# Altium project 110-00315-D_B1-DevKit_1.PrjPcb (part 3 of 5)

## Sheet 7-IO_Headers.SchDoc: B1 DevKit (DK-B1)
size 431 x 279 mm; Organization: ORGANIZATION; Address1: ADDRESS 1; Address2: ADDRESS 2; Address3: ADDRESS 3; Address4: ADDRESS 4; DocumentNumber: 7; Revision: -; SheetNumber: 7; SheetTotal: 14; ENG_APP_DATE: --/--/--; DSN_APP_DATE: --/--/--; CHK_APP_DATE: --/--/--
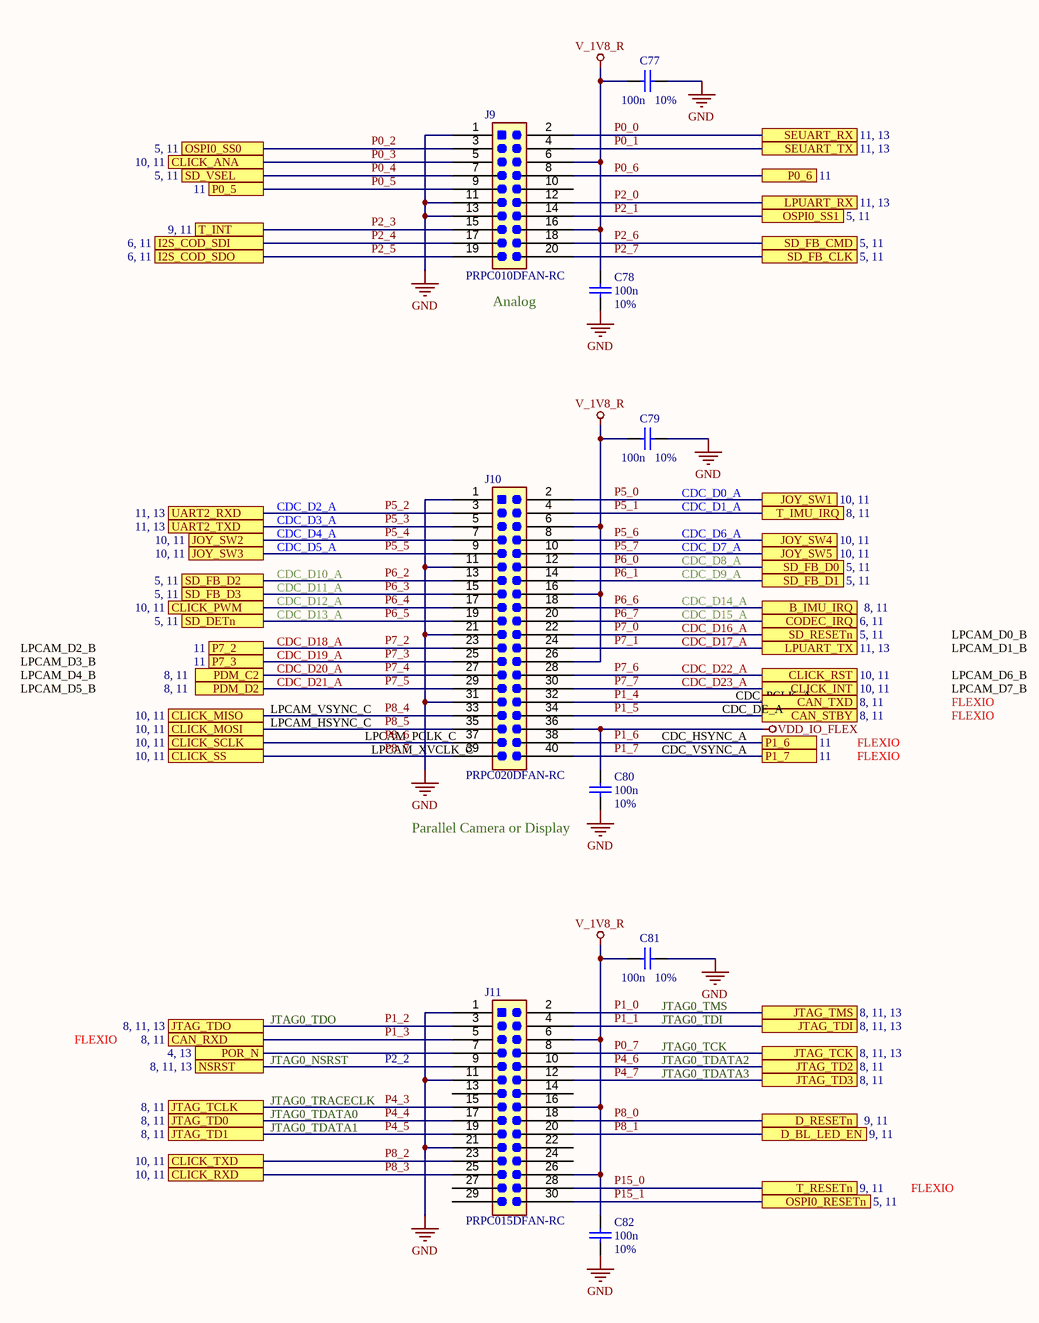
[diagram p6: 7-IO_Headers.SchDoc]

### Parts
C77  value 100n  Tolerance: 10%  [CAPC0402-01]  (hidden comment: Cap)
C78  value 100n  Tolerance: 10%  [CAPC0402-01]  (hidden comment: Cap)
C79  value 100n  Tolerance: 10%  [CAPC0402-01]  (hidden comment: Cap)
C80  value 100n  Tolerance: 10%  [CAPC0402-01]  (hidden comment: Cap)
C81  value 100n  Tolerance: 10%  [CAPC0402-01]  (hidden comment: Cap)
C82  value 100n  Tolerance: 10%  [CAPC0402-01]  (hidden comment: Cap)
J9  PRPC010DFAN-RC  [CON20_2X10_P100UM_HDR_TYC]
J10  PRPC020DFAN-RC  [CON40_2X20_P100UM_HDR_TYC]
J11  PRPC015DFAN-RC  [CON30_2X15_P100UM_HDR_TYC]

### Ports
B_IMU_IRQ (see 8, 11), CAN_RXD (see 8, 11), CAN_STBY (see 8, 11), CAN_TXD (see 8, 11), CLICK_ANA (see 10, 11), CLICK_INT (see 10, 11), CLICK_MISO (see 10, 11), CLICK_MOSI (see 10, 11), CLICK_PWM (see 10, 11), CLICK_RST (see 10, 11), CLICK_RXD (see 10, 11), CLICK_SCLK (see 10, 11), CLICK_SS (see 10, 11), CLICK_TXD (see 10, 11), CODEC_IRQ (see 6, 11), D_BL_LED_EN (see 9, 11), D_RESETn (see 9, 11), I2S_COD_SDI (see 6, 11), I2S_COD_SDO (see 6, 11), JOY_SW1 (see 10, 11), JOY_SW2 (see 10, 11), JOY_SW3 (see 10, 11), JOY_SW4 (see 10, 11), JOY_SW5 (see 10, 11), JTAG_TCK (see 8, 11, 13), JTAG_TCLK (see 8, 11), JTAG_TD0 (see 8, 11), JTAG_TD1 (see 8, 11), JTAG_TD2 (see 8, 11), JTAG_TD3 (see 8, 11), JTAG_TDI (see 8, 11, 13), JTAG_TDO (see 8, 11, 13), JTAG_TMS (see 8, 11, 13), LPUART_RX (see 11, 13), LPUART_TX (see 11, 13), NSRST (see 8, 11, 13), OSPI0_RESETn (see 5, 11), OSPI0_SS0 (see 5, 11), OSPI0_SS1 (see 5, 11), P0_5 (see 11), P0_6 (see 11), P1_6 (see 11), P1_7 (see 11), P7_2 (see 11), P7_3 (see 11), PDM_C2 (see 8, 11), PDM_D2 (see 8, 11), POR_N (see 4, 13), SD_DETn (see 5, 11), SD_FB_CLK (see 5, 11), SD_FB_CMD (see 5, 11), SD_FB_D0 (see 5, 11), SD_FB_D1 (see 5, 11), SD_FB_D2 (see 5, 11), SD_FB_D3 (see 5, 11), SD_RESETn (see 5, 11), SD_VSEL (see 5, 11), SEUART_RX (see 11, 13), SEUART_TX (see 11, 13), T_IMU_IRQ (see 8, 11), T_INT (see 9, 11), T_RESETn (see 9, 11), UART2_RXD (see 11, 13), UART2_TXD (see 11, 13)

### Nets
GND: C77.1 C78.1 C79.1 C80.1 C81.1 C82.1 J9.1 J9.11 J9.13 J10.1 J10.11 J10.21 J10.31 J11.1 J11.11 J11.21
V_1V8_R: C77.2 C78.2 C79.2 C81.2 C82.2 J9.6 J9.16 J10.6 J10.16 J10.26 J11.6 J11.16 J11.26
VDD_IO_FLEX: C80.2 J10.36
NSRST: J11.9 ; port NSRST
P0_0: J9.2 ; port SEUART_RX
P0_1: J9.4 ; port SEUART_TX
P0_2: J9.3 ; port OSPI0_SS0
P0_3: J9.5 ; port CLICK_ANA
P0_4: J9.7 ; port SD_VSEL
P0_5: J9.9 ; port P0_5
P0_6: J9.8 ; port P0_6
P0_7: J11.8 ; port JTAG_TCK
P1_0: J11.2 ; port JTAG_TMS
P1_1: J11.4 ; port JTAG_TDI
P1_2: J11.3 ; port JTAG_TDO
P1_3: J11.5 ; port CAN_RXD
P1_4: J10.32 ; port CAN_TXD
P1_5: J10.34 ; port CAN_STBY
P1_6: J10.38 ; port P1_6
P1_7: J10.40 ; port P1_7
P2_0: J9.12 ; port LPUART_RX
P2_1: J9.14 ; port OSPI0_SS1
P2_3: J9.15 ; port T_INT
P2_4: J9.17 ; port I2S_COD_SDI
P2_5: J9.19 ; port I2S_COD_SDO
P2_6: J9.18 ; port SD_FB_CMD
P2_7: J9.20 ; port SD_FB_CLK
P4_3: J11.15 ; port JTAG_TCLK
P4_4: J11.17 ; port JTAG_TD0
P4_5: J11.19 ; port JTAG_TD1
P4_6: J11.10 ; port JTAG_TD2
P4_7: J11.12 ; port JTAG_TD3
P5_0: J10.2 ; port JOY_SW1
P5_1: J10.4 ; port T_IMU_IRQ
P5_2: J10.3 ; port UART2_RXD
P5_3: J10.5 ; port UART2_TXD
P5_4: J10.7 ; port JOY_SW2
P5_5: J10.9 ; port JOY_SW3
P5_6: J10.8 ; port JOY_SW4
P5_7: J10.10 ; port JOY_SW5
P6_0: J10.12 ; port SD_FB_D0
P6_1: J10.14 ; port SD_FB_D1
P6_2: J10.13 ; port SD_FB_D2
P6_3: J10.15 ; port SD_FB_D3
P6_4: J10.17 ; port CLICK_PWM
P6_5: J10.19 ; port SD_DETn
P6_6: J10.18 ; port B_IMU_IRQ
P6_7: J10.20 ; port CODEC_IRQ
P7_0: J10.22 ; port SD_RESETn
P7_1: J10.24 ; port LPUART_TX
P7_2: J10.23 ; port P7_2
P7_3: J10.25 ; port P7_3
P7_4: J10.27 ; port PDM_C2
P7_5: J10.29 ; port PDM_D2
P7_6: J10.28 ; port CLICK_RST
P7_7: J10.30 ; port CLICK_INT
P8_0: J11.18 ; port D_RESETn
P8_1: J11.20 ; port D_BL_LED_EN
P8_2: J11.23 ; port CLICK_TXD
P8_3: J11.25 ; port CLICK_RXD
P8_4: J10.33 ; port CLICK_MISO
P8_5: J10.35 ; port CLICK_MOSI
P8_6: J10.37 ; port CLICK_SCLK
P8_7: J10.39 ; port CLICK_SS
P15_0: J11.28 ; port T_RESETn
P15_1: J11.30 ; port OSPI0_RESETn
POR_N: J11.7 ; port POR_N

Not connected (* = marked no-connect by the designer): J9 10; J11 13 14 22 24 27 29

### Notes on the sheet
- (near J9) Analog
- CDC_D2_A
- CDC_D3_A
- CDC_D1_A
- CDC_D0_A
- CDC_D4_A
- CDC_D5_A
- CDC_D10_A
- CDC_D6_A
- CDC_D7_A
- CDC_D8_A
- CDC_D9_A
- LPCAM_D2_B
- CDC_D11_A
- CDC_D12_A
- CDC_D13_A
- CDC_D18_A
- CDC_D19_A
- CDC_D14_A
- CDC_D15_A
- CDC_D16_A
- CDC_D17_A
- LPCAM_D1_B
- LPCAM_D0_B
- LPCAM_D3_B
- LPCAM_D4_B
- LPCAM_D5_B
- LPCAM_VSYNC_C
- CDC_D20_A
- CDC_D21_A
- CDC_D22_A
- CDC_D23_A
- CDC_DE_A
- CDC_PCLK_A
- LPCAM_D6_B
- LPCAM_D7_B
- FLEXIO
- LPCAM_HSYNC_C
- LPCAM_PCLK_C
- LPCAM_XVCLK_C
- CDC_VSYNC_A
- CDC_HSYNC_A
- (near C80) Parallel Camera or Display
- JTAG0_NSRST
- JTAG0_TDO
- JTAG0_TDI
- (near C81) JTAG0_TMS
- JTAG0_TCK
- JTAG0_TDATA2
- JTAG0_TRACECLK
- JTAG0_TDATA0
- P2_2
- JTAG0_TDATA3
- JTAG0_TDATA1
- DWG. NO.
- REV
- SHT
- REVISION
- DESCRIPTION
- DATE
- APPROVED
- ENG:
- APPROVALS
- PROJECT
- Suite 300
- Alif Semiconductor
- 7901 Stoneridge Drive
- DSN:
- CHK:
- REFERENCE DOCUMENTS
- TITLE
- Pleasanton, CA 94588  USA
- BOM:
- FAB DWG:
- PCB DWG:
- ASSY DWG:
- SCALE:
- SIZE
- B
- CAGE CODE
- FILE NAME
- DWG NO.
- SHEET
- OF
- none

### Library data of the parts
C77-C82 = Cap: Cap,100nF,10%,50V,X7R,0402; Manufacturer 1: TDK; Manufacturer Part Number 1: C1005X7R1H104K050BE; PCB_Footprint: CC0402; Published: 8-Jun-2000; LatestRevisionDate: 17-Jul-2002; LatestRevisionNote: Re-released for DXP Platform.; PackageReference: RAD-0.3; Publisher: Altium Limited; PackageDescription: Radial Cap, Thru-Hole; 2 Leads; 0.3 in Pin Spacing; Max_Height: 0.60mm; Manufacturer 2: Samsung; Manufacturer Part Number 2: CL05B104KB54PNC; Manufacturer 3: Walsin; Manufacturer Part Number 3: 0402B104K500CT; Type: X7R; Voltage: 50V
J9 = Hdr_M_2X10_2M54_STRT_UNSHROUDED: Hdr, Male,2x10, 0.1"x0.1", Strt,Mate Ht 0.318",Tail Ht 0.120",Unshrouded; Manufacturer 1: Sullins; Manufacturer Part Number 1: PRPC010DFAN-RC; PCB_Footprint: *
J10 = Hdr_M_2X20_2M54_STRT_UNSHROUDED: Hdr, Male,2x20, 0.1"x0.1", Strt,Mate Ht 0.318",Tail Ht 0.120",Unshrouded; Manufacturer 1: Sullins; PCB_Footprint: HDR,2x20,2M54,STRT,UNSHROUD; Manufacturer Part Number 1: PRPC020DFAN-RC
J11 = Hdr_M_2X15_2M54_STRT_UNSHROUDED: Hdr, Male,2x15, 0.1"x0.1", Strt,Mate Ht 0.318",Tail Ht 0.120",Unshrouded; Manufacturer 1: Sullins; Manufacturer Part Number 1: PRPC015DFAN-RC; PCB_Footprint: *

## Sheet 8-SensorsAndJTAG.SchDoc: B1 DevKit (DK-B1)
size 431 x 279 mm; Organization: ORGANIZATION; Address1: ADDRESS 1; Address2: ADDRESS 2; Address3: ADDRESS 3; Address4: ADDRESS 4; DocumentNumber: 8; Revision: -; SheetNumber: 8; SheetTotal: 14; ENG_APP_DATE: --/--/--; DSN_APP_DATE: --/--/--; CHK_APP_DATE: --/--/--
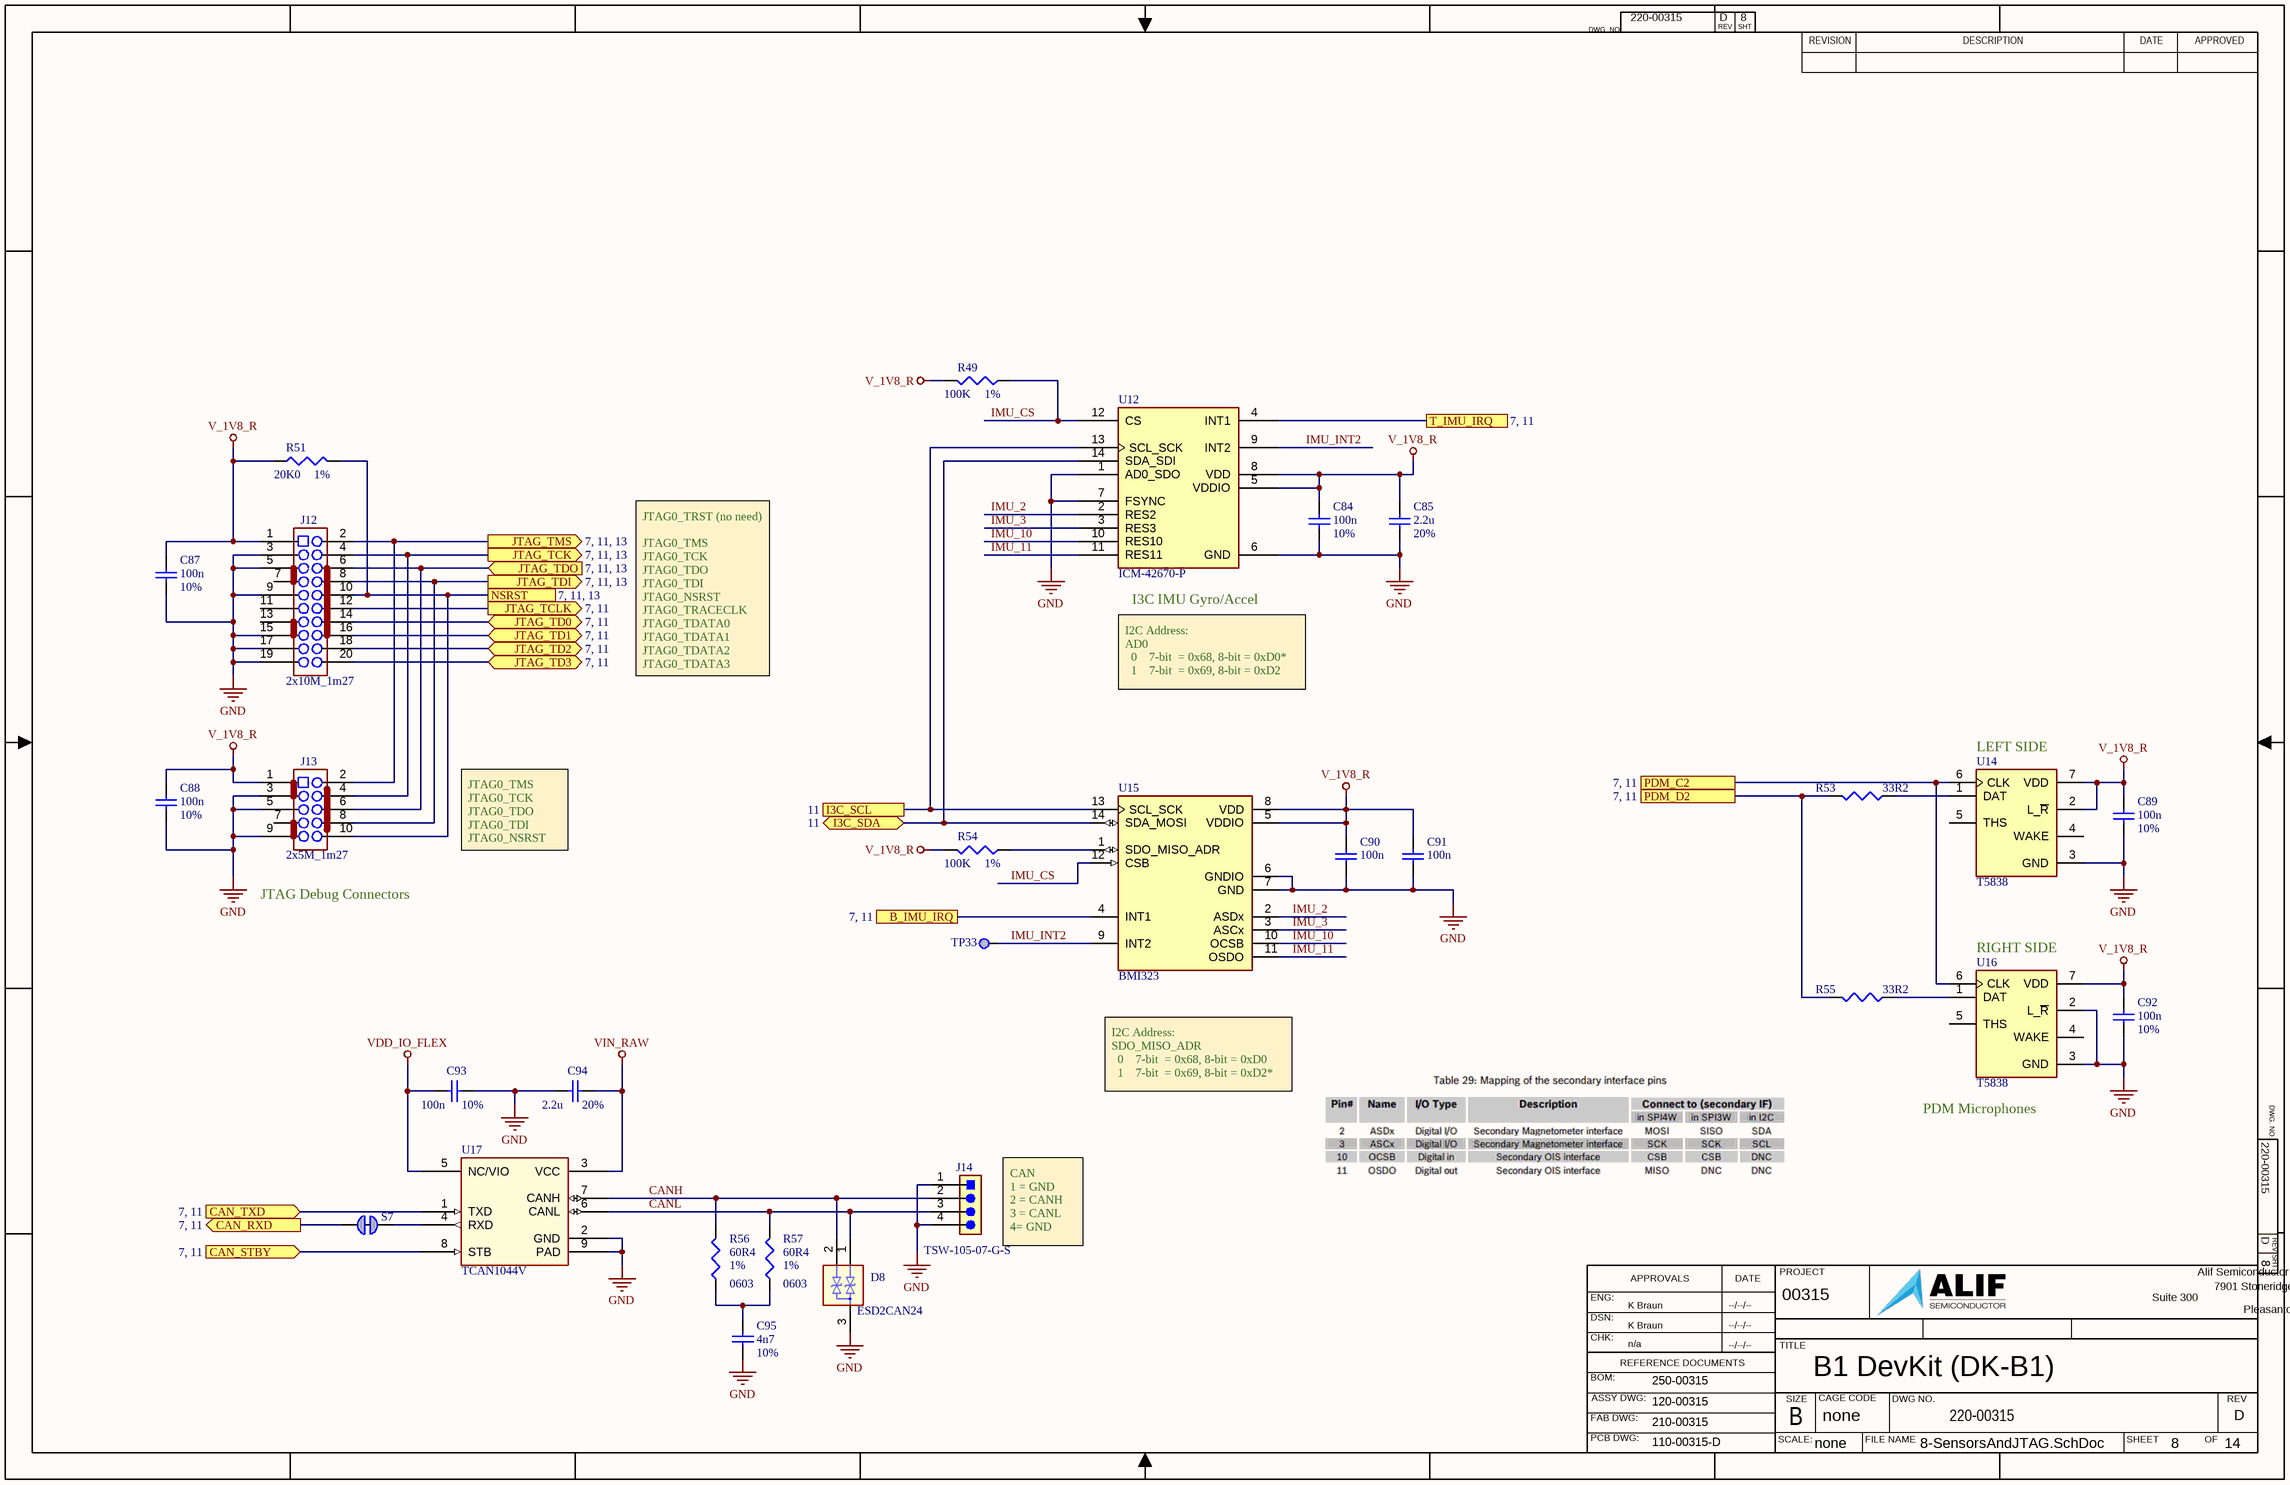
[diagram p7: 8-SensorsAndJTAG.SchDoc]

### Parts
C84  value 100n  Tolerance: 10%  [CAPC0402-01]  (hidden comment: Cap)
C85  value 2.2u  Tolerance: 20%  [CAPC0402-01]  (hidden comment: Cap_225M25VX5R0402_1)
C87  value 100n  Tolerance: 10%  [CAPC0402-01]  (hidden comment: Cap)
C88  value 100n  Tolerance: 10%  [CAPC0402-01]  (hidden comment: Cap)
C89  value 100n  Tolerance: 10%  [CAPC0402-01]  (hidden comment: Cap)
C90  value 100n  [CAPC0402-01]  (hidden comment: Cap)
C91  value 100n  [CAPC0402-01]  (hidden comment: Cap)
C92  value 100n  Tolerance: 10%  [CAPC0402-01]  (hidden comment: Cap)
C93  value 100n  Tolerance: 10%  [CAPC0402-01]  (hidden comment: Cap)
C94  value 2.2u  Tolerance: 20%  [CAPC0402-01]  (hidden comment: Cap_225M25VX5R0402_1)
C95  value 4n7  Tolerance: 10%  [CAPC0402-01]  (hidden comment: Cap)
D8  ESD2CAN24  [WE-TVS_SOT23-3L]
J12  value 2x10M_1m27  [SAMTEC_FTSH-110-01-X-DV-007-K]  (hidden comment: Hdr_M_2X10_1M27_STRT_KEY_CORTEX_1)
J13  value 2x5M_1m27  [SAMTEC_FTSH-105-01-DV-007-K]  (hidden comment: Hdr_M_2X5_1M27_STRT_KEY_CORTEX_1)
J14  TSW-105-07-G-S  [CONN_HDR_1X4_STRT_0.100]
R49  value 100K  Tolerance: 1%  [RESC0402-01]  (hidden comment: Res3)
R51  value 20K0  Tolerance: 1%  [RESC0402-01]  (hidden comment: Res3)
R53  value 33R2  [RESC0402-01]  (hidden comment: Res3)
R54  value 100K  Tolerance: 1%  [RESC0402-01]  (hidden comment: Res3)
R55  value 33R2  [RESC0402-01]  (hidden comment: Res3)
R56  value 60R4  PCB_Footprint: 0603  Tolerance: 1%  [RESC0603-01]  (hidden comment: Res3)
R57  value 60R4  PCB_Footprint: 0603  Tolerance: 1%  [RESC0603-01]  (hidden comment: Res3)
S7  SolderJumperShorted_Small  [Solderbridge_Shorted]  (value not drawn)  (net tie, no BOM)
TP33  TP_SMPAD  [TP_30_RND]  (value not drawn)  (no BOM)
U12  Manufacturer Part Number 1: ICM-42670-P  [IC_ICM-42670-P]  (hidden comment: ICM-42670-P_1)
U14  T5838  [MIC_T5838]
U15  BMI323  [PQFN50P250X300X88-14N]
U16  T5838  [MIC_T5838]
U17  TCAN1044V  [DFN8_2x3_SON8_DRB_TEX-M]

### Ports
B_IMU_IRQ (see 7, 11), CAN_RXD (out, see 7, 11), CAN_STBY (in, see 7, 11), CAN_TXD (in, see 7, 11), I3C_SCL (see 11), I3C_SDA (bidir, see 11), JTAG_TCK (out, see 7, 11, 13), JTAG_TCLK (out, see 7, 11), JTAG_TD0 (bidir, see 7, 11), JTAG_TD1 (bidir, see 7, 11), JTAG_TD2 (bidir, see 7, 11), JTAG_TD3 (bidir, see 7, 11), JTAG_TDI (out, see 7, 11, 13), JTAG_TDO (in, see 7, 11, 13), JTAG_TMS (out, see 7, 11, 13), NSRST (see 7, 11, 13), PDM_C2 (see 7, 11), PDM_D2 (see 7, 11), T_IMU_IRQ (see 7, 11)

### Nets
GND: C84.2 C85.1 C87.2 C88.2 C89.2 C90.2 C91.2 C92.2 C93.1 C94.2 C95.1 D8.3 J12.3 J12.5 J12.9 J12.15 J12.17 J12.19 J13.3 J13.5 J13.9 J14.1 J14.4 U12.1(AD0_SDO) U12.6(GND) U12.7(FSYNC) U14.3(GND) U15.6(GNDIO) U15.7(GND) U16.2(L_~{R}) U16.3(GND) U17.2(GND) U17.9(PAD)
V_1V8_R: C84.1 C85.2 C87.1 C88.1 C89.1 C90.1 C91.1 C92.1 J12.1 J13.1 R49.2 R51.1 R54.2 U12.5(VDDIO) U12.8(VDD) U14.2(L_~{R}) U14.7(VDD) U15.5(VDDIO) U15.8(VDD) U16.7(VDD)
VDD_IO_FLEX: C93.2 U17.5(NC/VIO)
VIN_RAW: C94.1 U17.3(VCC)
CANH: D8.2 J14.2 R56.2 U17.7(CANH)
CANL: D8.1 J14.3 R57.2 U17.6(CANL)
I3C_SCL: U12.13(SCL_SCK) U15.13(SCL_SCK) ; port I3C_SCL
I3C_SDA: U12.14(SDA_SDI) U15.14(SDA_MOSI) ; port I3C_SDA
IMU_2: U12.2(RES2) U15.2(ASDx)
IMU_3: U12.3(RES3) U15.3(ASCx)
IMU_10: U12.10(RES10) U15.10(OCSB)
IMU_11: U12.11(RES11) U15.11(OSDO)
IMU_CS: R49.1 U12.12(CS) U15.12(CSB)
IMU_INT2: TP33.1 U12.9(INT2) U15.9(INT2)
NSRST: J12.10 J13.10 R51.2 ; port NSRST
P0_7: J12.4 J13.4 ; port JTAG_TCK
P1_0: J12.2 J13.2 ; port JTAG_TMS
P1_1: J12.8 J13.8 ; port JTAG_TDI
P1_2: J12.6 J13.6 ; port JTAG_TDO
P1_3: S7.1 ; port CAN_RXD
P1_4: U17.1(TXD) ; port CAN_TXD
P1_5: U17.8(STB) ; port CAN_STBY
P4_3: J12.12 ; port JTAG_TCLK
P4_4: J12.14 ; port JTAG_TD0
P4_5: J12.16 ; port JTAG_TD1
P4_6: J12.18 ; port JTAG_TD2
P4_7: J12.20 ; port JTAG_TD3
P5_1: U12.4(INT1) ; port T_IMU_IRQ
P6_6: U15.4(INT1) ; port B_IMU_IRQ
P7_4: U14.6(CLK) U16.6(CLK) ; port PDM_C2
P7_5: R53.2 R55.2 ; port PDM_D2
NetC95_2: C95.2 R56.1 R57.1
NetR53_1: R53.1 U14.1(DAT)
NetR54_1: R54.1 U15.1(SDO_MISO_ADR)
NetR55_1: R55.1 U16.1(DAT)
NetS7_2: S7.2 U17.4(RXD)

Not connected (* = marked no-connect by the designer): J12 7 11 13; J13 7; U14 4(WAKE) 5(THS); U16 4(WAKE) 5(THS)

### Notes on the sheet
- (near U12) I3C IMU Gyro/Accel
- JTAG0_TRST (no need)
  JTAG0_TMS
  JTAG0_TCK
  JTAG0_TDO
  JTAG0_TDI
  JTAG0_NSRST
  JTAG0_TRACECLK
  JTAG0_TDATA0
  JTAG0_TDATA1
  JTAG0_TDATA2
  JTAG0_TDATA3
- I2C Address:
  AD0
  0    7-bit  = 0x68, 8-bit = 0xD0*
  1    7-bit  = 0x69, 8-bit = 0xD2
- (near U14) LEFT SIDE
- (near J13) JTAG Debug Connectors
- JTAG0_TMS
  JTAG0_TCK
  JTAG0_TDO
  JTAG0_TDI
  JTAG0_NSRST
- (near U16) RIGHT SIDE
- I2C Address:
  SDO_MISO_ADR
  0    7-bit  = 0x68, 8-bit = 0xD0
  1    7-bit  = 0x69, 8-bit = 0xD2*
- (near U16) PDM Microphones
- (near J14) CAN
  1 = GND
  2 = CANH
  3 = CANL
  4= GND
- DWG. NO.
- REV
- SHT
- REVISION
- DESCRIPTION
- DATE
- APPROVED
- ENG:
- APPROVALS
- PROJECT
- Suite 300
- Alif Semiconductor
- 7901 Stoneridge Drive
- DSN:
- CHK:
- REFERENCE DOCUMENTS
- TITLE
- Pleasanton, CA 94588  USA
- BOM:
- FAB DWG:
- PCB DWG:
- ASSY DWG:
- SCALE:
- SIZE
- B
- CAGE CODE
- FILE NAME
- DWG NO.
- SHEET
- OF
- none

### Library data of the parts
C84 C87-C93 = Cap: as C77-C82 on sheet 7-IO_Headers; Published: 8-Jun-2000; LatestRevisionDate: 17-Jul-2002; LatestRevisionNote: Re-released for DXP Platform.; PackageReference: RAD-0.3; Publisher: Altium Limited; PackageDescription: Radial Cap, Thru-Hole; 2 Leads; 0.3 in Pin Spacing; Max_Height: 0.60mm; Manufacturer 2: Samsung; Manufacturer Part Number 2: CL05B104KB54PNC; Manufacturer 3: Walsin; Manufacturer Part Number 3: 0402B104K500CT; Type: X7R; Voltage: 50V
  C90 C91: Tolerance: 10%
C85 C94 = Cap_225M25VX5R0402_1: Cap,2.2uF,20%,25V,X5R,0402; Manufacturer 1: TDK; Manufacturer Part Number 1: C1005X5R1E225M050BC; PCB_Footprint: CC0402; Published: 8-Jun-2000; LatestRevisionDate: 17-Jul-2002; LatestRevisionNote: Re-released for DXP Platform.; PackageReference: RAD-0.3; Publisher: Altium Limited; PackageDescription: Radial Cap, Thru-Hole; 2 Leads; 0.3 in Pin Spacing; Max_Height: 0.60mm; Manufacturer 2: Murata; Manufacturer Part Number 2: GRM155R61E225ME11D; Manufacturer 3: Murata; Manufacturer Part Number 3: GRM155R61E225ME15D; Type: X5R; Voltage: 25V
C95 = Cap: Cap,4.7nF,10%,100V,X7R,0402; Manufacturer 1: MuRata; Manufacturer Part Number 1: GCM155R72A472KA37D; PCB_Footprint: CC0402; Published: 8-Jun-2000; LatestRevisionDate: 17-Jul-2002; LatestRevisionNote: Re-released for DXP Platform.; PackageReference: RAD-0.3; Publisher: Altium Limited; PackageDescription: Radial Cap, Thru-Hole; 2 Leads; 0.3 in Pin Spacing; Max_Height: 0.60mm; Manufacturer 2: Wurth; Manufacturer Part Number 2: 885012205084; Manufacturer 3: Vishay; Manufacturer Part Number 3: VJ0402Y472KXBAC; Type: X7R; Voltage: 100V
D8 = D_ESD_ESD2CAN24DBZRQ1: Diode,TVS  – High Speed Series, SOT23-3, 2 Channel, 24Vdc, 12pF; Manufacturer 1: TI; Manufacturer Part Number 1: ESD2CAN24DBZRQ1; Manufacturer 2: Nexpheria; Manufacturer Part Number 2: PESD2CAN24T-QR
J12 = Hdr_M_2X10_1M27_STRT_KEY_CORTEX_1: Hdr,Male,2x10,1.27mm,Strt,Keyed,Cortex-JTAG; Manufacturer 1: Samtec; Manufacturer Part Number 1: FTSH-110-01-L-DV-007-K; PCB_Footprint: FTSH-110-01-X-DV-007-K
J13 = Hdr_M_2X5_1M27_STRT_KEY_CORTEX_1: Hdr,Male,2x5,1.27mm,Strt,Keyed,Cortex-JTAG; Manufacturer 1: Samtec; PCB_Footprint: FTSH-105-01-L-DV-007-K; Manufacturer Part Number 1: FTSH-105-01-L-DV-007-K
J14 = Hdr_M_1X4_2M54_STRT_UNSHROUD: Hdr, 0.025" SQ Post Header, Thru-hole, Vertical, 2.54 mm Pitch, 4-Pin, Male, RoHS; Manufacturer: Samtec; Manufacturer Part Number 1: TSW-104-07-G-S; Pitch: 2.54 mm; ComponentLink3URL: http://www.samtec.com/documents/webfiles/cpdf/TSW-XXX-XX-XXX-X-XX-XXX-MKT.pdf; Temperature Range: -55 to 125 degC; DatasheetVersion: F-214; ComponentLink1Description: Manufacturer URL; ComponentLink2URL: http://www.samtec.com/documents/webfiles/pdf/TSW_TH.PDF; RoHS: True; Orientation: Vertical; ComponentLink2Description: Datasheet; ComponentLink3Description: Package Specification; PackageDescription: .025[0.64] SQ. Post Terminal Strip Assembly; Mounting Technology: Through-hole; PackageVersion: DM, 8/1988; ComponentLink1URL: http://www.samtec.com; PackageReference: *; PartNumber: *; Manufacturer 1: Samtec
R49 R54 = Res3: Res,100K,1%,100ppm,0402; Manufacturer 1: Stackpol; Manufacturer Part Number 1: RMCF0402FT100K; Wattage: 63mW; Published: 8-Jun-2000; LatestRevisionDate: 29-May-2009; LatestRevisionNote: IPC-7351 Footprint Added.; PackageReference: RESC0402-01; Publisher: Altium Limited; PackageDescription: Chip Resistor; Voltage: *; Type: Thick Film; Manufacturer 2: Yageo; Manufacturer Part Number 2: RC0402FR-07100KL; Manufacturer 3: Bourns; Manufacturer Part Number 3: CR0402-FX-1003GLF; PCB_Footprint: RESC0402-01
R51 = Res3: Res,20K0,1%,100ppm,0402; Manufacturer 1: Stackpol; Manufacturer Part Number 1: RMCF0402FT20K0; Wattage: 63mW; Published: 8-Jun-2000; LatestRevisionDate: 29-May-2009; LatestRevisionNote: IPC-7351 Footprint Added.; PackageReference: RESC0402-01; Publisher: Altium Limited; PackageDescription: Chip Resistor; Voltage: *; Type: Thick Film; Manufacturer 2: Yageo; Manufacturer Part Number 2: RC0402FR-0720KL; Manufacturer 3: Bourns; Manufacturer Part Number 3: CR0402-FX-2002GLF; PCB_Footprint: RESC0402-01
R53 R55 = Res3: Res,33R2,1%,100ppm,0402; Manufacturer 1: Stackpol; Manufacturer Part Number 1: RMCF0402FT33R2; Wattage: 63mW; Published: 8-Jun-2000; LatestRevisionDate: 29-May-2009; LatestRevisionNote: IPC-7351 Footprint Added.; PackageReference: RESC0402-01; Publisher: Altium Limited; PackageDescription: Chip Resistor; Voltage: *; Type: Thick Film; Manufacturer 2: Yageo; Manufacturer Part Number 2: RC0402FR-0733R2L; Manufacturer 3: Bourns; Manufacturer Part Number 3: CR0402-FX-33R2GLF; PCB_Footprint: RESC0402-01; Tolerance: 1%
R56 R57 = Res3: Res,60R4,1%,100ppm,0603; Manufacturer 1: KOA; Manufacturer Part Number 1: RK73H1JTTD60R4F; Wattage: 100mW; Published: 8-Jun-2000; LatestRevisionDate: 29-May-2009; LatestRevisionNote: IPC-7351 Footprint Added.; PackageReference: 0603; Publisher: Altium Limited; PackageDescription: Chip Resistor; Voltage: *; Type: Thick Film; Manufacturer 2: Yageo; Manufacturer Part Number 2: RC0603FR-0760R4L; Manufacturer 3: Vishay; Manufacturer Part Number 3: CRCW060360R4FKEA
S7 = SolderJumperShorted_Small: DNI,Solderable Jumper,Shorted; Wattage: 63mW; PCB_Footprint: SSHORTED; Published: 8-Jun-2000; LatestRevisionDate: 29-May-2009; LatestRevisionNote: IPC-7351 Footprint Added.; PackageReference: J1-0603; Publisher: Altium Limited; PackageDescription: Chip Resistor; Voltage: *; Type: Thick Film; Manufacturer 1: *; Manufacturer Part Number 1: *; Manufacturer 2: *; Manufacturer Part Number 2: *; Manufacturer 3: *; Manufacturer Part Number 3: *; Tolerance: *; Value: *
TP33 = TP_SMPAD: DNI,Test Point, SMT Pad,--not a BOM item--; PCB_Footprint: TP_PAD1
U12 = ICM-42670-P_1: IC, IMU Gyro & Accel, I3C, 1.8V, LGA14; Manufacturer 1: TDK_Invensense; Value: Gyro_Accel
U14 U16 = MIC_T5838: IC,Microphone,PDM,Bottom Port,Sens -37db,SNR 68dbA,AOP 13db SPL,1.8V; Manufacturer 1: TDK; Manufacturer Part Number 1: MMICT5838-00-012; Value: PDM Mic; Voltage: *; Current: *; Tolerance: *; Max_Height: 0.60mm; PCB_Footprint: T5838
U15 = IC_IMU_BMI323: IC,IMU,6 Axis Sensor I3C, SPI, LGA14; MF: Bosch; Digi-Key_Purchase_URL: https://www.digikey.com/product-detail/en/bosch-sensortec/BNO055/828-1058-1-ND/6136309?utm_source=snapeda&utm_medium=aggregator&utm_campaign=symbol; Value: *; Package: LGA-14 Bosch; Manufacturer Part Number 1: BMI323; SnapEDA_Link: https://www.snapeda.com/parts/BNO055/Bosch%20Sensortec/view-part/51961/?ref=snap; Digi-Key_Part_Number: *; Manufacturer 1: Bosch; Manufacturer Prt Number 1: BMI323
U17 = IC_CAN_TCAN1044VDRBRQ1: IC, CAN Transceiver, 1.7V-5.5V, DFN8(2x3); Manufacturer 1: TI; Manufacturer Part Number 1: TCAN1044VDRBRQ1; Type: Type

## Sheet 9-MIPI.SchDoc: B1 DevKit (DK-B1)
size 431 x 279 mm; Organization: ORGANIZATION; Address1: ADDRESS 1; Address2: ADDRESS 2; Address3: ADDRESS 3; Address4: ADDRESS 4; DocumentNumber: 9; Revision: -; SheetNumber: 9; SheetTotal: 14; ENG_APP_DATE: --/--/--; DSN_APP_DATE: --/--/--; CHK_APP_DATE: --/--/--
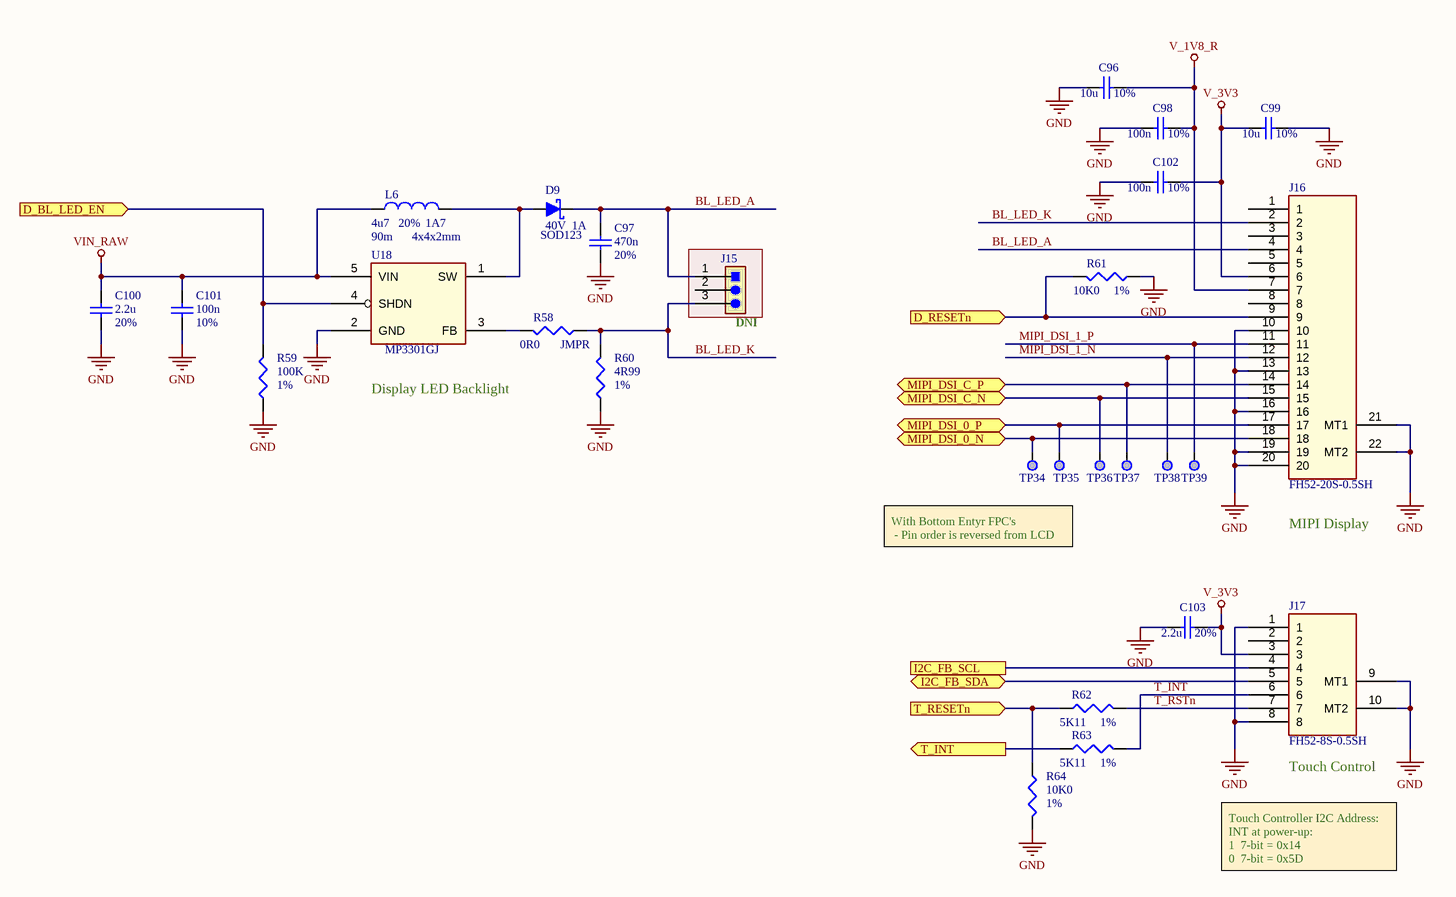
[diagram p8: 9-MIPI.SchDoc]

### Parts
C96  value 10u  Tolerance: 10%  [CAPC0402-01]  (hidden comment: Cap)
C97  value 470n  Tolerance: 20%  [CAPC0402-01]  (hidden comment: Cap)
C98  value 100n  Tolerance: 10%  [CAPC0402-01]  (hidden comment: Cap)
C99  value 10u  Tolerance: 10%  [CAPC0402-01]  (hidden comment: Cap)
C100  value 2.2u  Tolerance: 20%  [CAPC0402-01]  (hidden comment: Cap_225M25VX5R0402_1)
C101  value 100n  Tolerance: 10%  [CAPC0402-01]  (hidden comment: Cap)
C102  value 100n  Tolerance: 10%  [CAPC0402-01]  (hidden comment: Cap)
C103  value 2.2u  Tolerance: 20%  [CAPC0402-01]  (hidden comment: Cap_225M25VX5R0402_1)
D9  value 40V  1A  PackageDescription: SOD123  [SOD123F_NXP]  (hidden comment: D Schottky)
J15  TSW-103-07-G-S  [CONN_HDR_1X3_STRT_0.100_no3D]  (value not drawn)
J16  FH52-20S-0.5SH  [CONN_FPC_BOT-ENT_FRONT-LOCK_0.50_20_reversed]
J17  FH52-8S-0.5SH  [CONN_FPC_BOT-ENT_FRONT-LOCK_0.50_8_reversed]
L6  value 4u7  PackageDescription: 4x4x2mm  DCR: 90m  RMS_Current: 1A7  Tolerance: 20%  [IND_IFSC_1515AH_VIS-M]  (hidden comment: Inductor)
R58  value 0R0  Tolerance: JMPR  [RESC0402-01]  (hidden comment: Res3)
R59  value 100K  Tolerance: 1%  [RESC0402-01]  (hidden comment: Res3)
R60  value 4R99  Tolerance: 1%  [RESC0402-01]  (hidden comment: Res3)
R61  value 10K0  Tolerance: 1%  [RESC0402-01]  (hidden comment: Res3)
R62  value 5K11  Tolerance: 1%  [RESC0402-01]  (hidden comment: Res3)
R63  value 5K11  Tolerance: 1%  [RESC0402-01]  (hidden comment: Res3)
R64  value 10K0  Tolerance: 1%  [RESC0402-01]  (hidden comment: Res3)
TP34  TP_SMPAD  [TP_30_RND]  (value not drawn)  (no BOM)
TP35  TP_SMPAD  [TP_30_RND]  (value not drawn)  (no BOM)
TP36  TP_SMPAD  [TP_30_RND]  (value not drawn)  (no BOM)
TP37  TP_SMPAD  [TP_30_RND]  (value not drawn)  (no BOM)
TP38  TP_SMPAD  [TP_30_RND]  (value not drawn)  (no BOM)
TP39  TP_SMPAD  [TP_30_RND]  (value not drawn)  (no BOM)
U18  MP3301GJ  [TSOT23-5_ONS]

### Ports
D_BL_LED_EN (in), D_RESETn (in), I2C_FB_SCL, I2C_FB_SDA (bidir), MIPI_DSI_0_N (bidir), MIPI_DSI_0_P (bidir), MIPI_DSI_C_N (bidir), MIPI_DSI_C_P (bidir), T_INT (out), T_RESETn (in)

### Nets
GND: C96.2 C97.2 C98.2 C99.1 C100.1 C101.2 C102.2 C103.2 J16.10 J16.13 J16.16 J16.19 J16.20 J16.21(MT1) J16.22(MT2) J17.1 J17.8 J17.9(MT1) J17.10(MT2) R59.1 R60.1 R61.1 R64.2 U18.2(GND)
V_1V8_R: C96.1 C98.1 J16.7
V_3V3: C99.2 C102.1 C103.1 J16.6 J17.3
VIN_RAW: C100.2 C101.1 L6.1 U18.5(VIN)
BL_LED_A: C97.1 D9.1(K) J15.1 J16.4
BL_LED_K: J15.3 J16.2 R58.1 R60.2
I2C_FB_SCL: J17.4 ; port I2C_FB_SCL
I2C_FB_SDA: J17.5 ; port I2C_FB_SDA
MIPI_DSI_0_N: J16.18 TP34.1 ; port MIPI_DSI_0_N
MIPI_DSI_0_P: J16.17 TP35.1 ; port MIPI_DSI_0_P
MIPI_DSI_1_N: J16.12 TP38.1
MIPI_DSI_1_P: J16.11 TP39.1
MIPI_DSI_C_N: J16.15 TP36.1 ; port MIPI_DSI_C_N
MIPI_DSI_C_P: J16.14 TP37.1 ; port MIPI_DSI_C_P
P2_3: R63.1 ; port T_INT
P8_0: J16.9 R61.2 ; port D_RESETn
P8_1: R59.2 U18.4(SHDN) ; port D_BL_LED_EN
P15_0: R62.1 R64.1 ; port T_RESETn
T_INT: J17.6 R63.2
T_RSTn: J17.7 R62.2
NetD9_2: D9.2(A) L6.2 U18.1(SW)
NetR58_2: R58.2 U18.3(FB)

Not connected (* = marked no-connect by the designer): J15 2; J16 1 3 5 8; J17 2

### Notes on the sheet
- (near J15) DNI
- Display LED Backlight
- With Bottom Entyr FPC's
  - Pin order is reversed from LCD
- (near J16) MIPI Display
- (near J17) Touch Control
- Touch Controller I2C Address:
  INT at power-up:
  1  7-bit = 0x14
  0  7-bit = 0x5D
- DWG. NO.
- REV
- SHT
- REVISION
- DESCRIPTION
- DATE
- APPROVED
- ENG:
- APPROVALS
- PROJECT
- Suite 300
- Alif Semiconductor
- 7901 Stoneridge Drive
- DSN:
- CHK:
- REFERENCE DOCUMENTS
- TITLE
- Pleasanton, CA 94588  USA
- BOM:
- FAB DWG:
- PCB DWG:
- ASSY DWG:
- SCALE:
- SIZE
- B
- CAGE CODE
- FILE NAME
- DWG NO.
- SHEET
- OF
- none

### Library data of the parts
C96 C99 = Cap: Cap,10uF,20%,10V,X5R,0402; Manufacturer 1: AVX; Manufacturer Part Number 1: 0402ZD106MAT2A; PCB_Footprint: CC0402; Published: 8-Jun-2000; LatestRevisionDate: 17-Jul-2002; LatestRevisionNote: Re-released for DXP Platform.; PackageReference: RAD-0.3; Publisher: Altium Limited; PackageDescription: Radial Cap, Thru-Hole; 2 Leads; 0.3 in Pin Spacing; Max_Height: 0.60mm; Manufacturer 2: Samsung; Manufacturer Part Number 2: CL05A106MP5NUNC; Manufacturer 3: Venkel; Manufacturer Part Number 3: C0402X5R100-106MNP; Type: X5R; Voltage: 10V
C97 = Cap: Cap,470nF,20%,50V,X5R,0402; Manufacturer 1: MuRata; Manufacturer Part Number 1: GRM155R61H474ME11D; PCB_Footprint: CC0402; Type: X7R; Published: 8-Jun-2000; LatestRevisionDate: 17-Jul-2002; LatestRevisionNote: Re-released for DXP Platform.; PackageReference: RAD-0.3; Publisher: Altium Limited; PackageDescription: Radial Cap, Thru-Hole; 2 Leads; 0.3 in Pin Spacing; Max_Height: 0.60mm; Manufacturer 2: Cal-Chip; Manufacturer Part Number 2: GMC04X5R474M50NT; Manufacturer 3: *; Manufacturer Part Number 3: *; Voltage: 50V
C98 C101 C102 = Cap: as C77-C82 on sheet 7-IO_Headers; Published: 8-Jun-2000; LatestRevisionDate: 17-Jul-2002; LatestRevisionNote: Re-released for DXP Platform.; PackageReference: RAD-0.3; Publisher: Altium Limited; PackageDescription: Radial Cap, Thru-Hole; 2 Leads; 0.3 in Pin Spacing; Max_Height: 0.60mm; Manufacturer 2: Samsung; Manufacturer Part Number 2: CL05B104KB54PNC; Manufacturer 3: Walsin; Manufacturer Part Number 3: 0402B104K500CT; Type: X7R; Voltage: 50V
C100 C103 = Cap_225M25VX5R0402_1: as C85 on sheet 8-SensorsAndJTAG; Published: 8-Jun-2000; LatestRevisionDate: 17-Jul-2002; LatestRevisionNote: Re-released for DXP Platform.; PackageReference: RAD-0.3; Publisher: Altium Limited; PackageDescription: Radial Cap, Thru-Hole; 2 Leads; 0.3 in Pin Spacing; Max_Height: 0.60mm; Manufacturer 2: Murata; Manufacturer Part Number 2: GRM155R61E225ME11D; Manufacturer 3: Murata; Manufacturer Part Number 3: GRM155R61E225ME15D; Type: X5R; Voltage: 25V
D9 = D Schottky: Diode,Schottky,1A,40V,SOD123; Manufacturer 1: ST; Manufacturer Part Number 1: STPS140ZY; Published: 8-Jun-2000; LatestRevisionDate: 17-Jul-2002; LatestRevisionNote: Re-released for DXP Platform.; PackageReference: SOD123; Publisher: Altium Limited; Code_JEDEC: SOD123; Manufacturer 2: Panjit; Manufacturer Part Number 2: SBA140AS_R1_00001; Manufacturer 3: Nexpheria; Manufacturer Part Number 3: PMEG4010EH,115
J15 = Hdr_M_1X3_2M54_STRT_UNSHROUD: DNI,Hdr, 0.025" SQ Post Header, Through-hole, Vertical, -55 to 125 degC, 2.54 mm Pitch, 3-Pin, Male, RoHS; Manufacturer: Samtec; Pitch: 2.54 mm; ComponentLink3URL: http://www.samtec.com/documents/webfiles/cpdf/TSW-XXX-XX-XXX-X-XX-XXX-MKT.pdf; Temperature Range: -55 to 125 degC; DatasheetVersion: F-214; ComponentLink1Description: Manufacturer URL; ComponentLink2URL: http://www.samtec.com/documents/webfiles/pdf/TSW_TH.PDF; RoHS: True; Orientation: Vertical; ComponentLink2Description: Datasheet; ComponentLink3Description: Package Specification; PackageDescription: .025[0.64] SQ. Post Terminal Strip Assembly; Mounting Technology: Through-hole; PackageVersion: DM, 8/1988; ComponentLink1URL: http://www.samtec.com; PackageReference: TSW-103-07-X-S; PartNumber: TSW-103-07-G-S; Manufacturer 1: Samtec; Manufacturer Part Number 1: TSW-103-07-G-S; Manufacturer 2: Sullins; Manufacturer Part Number 2: PRPC003SAAN-RC; Manufacturer 3: 3M; Manufacturer Part Number 3: 929647-01-03-I
J16 = Conn_FFC_BOT_SLIDEorLOCK_0.50_20pin: Conn,FlatFlex,20 pin,0.50mm,bottom-entry,slide-flap,SMT; Manufacturer 1: HiRose; Copyright: Copyright (C) 2022 Ultra Librarian. All rights reserved.; Manufacturer Part Number 1: FH52-20S-0.5SH; Manufacturer 2: HiRose; Manufacturer Part Number 2: FH52-20S-0.5SH(99); Manufacturer 3: Molex; Manufacturer Part Number 3: 5051102091; RefDes: RefDes; Type: DEV
J17 = Conn_FFC_BOT_SLIDorLOCK_0.50_8pin: Conn,FlatFlex,8 pin,0.50mm,bottom-entry,slide-flap,SMT; Mfr_Name: Omron; Manufacturer 1: HiRose; Manufacturer Part Number 1: FH52E-8S-0.5SH(99); Copyright: Copyright (C) 2022 Ultra Librarian. All rights reserved.; *: *; Digi-Key_Part_Number_3: *; Digi-Key_Part_Number_4: *; RefDes: RefDes; Type: DEV; Manufacturer 2: HiRose; Manufacturer Part Number 2: FH52-8S-0.5SH(99)
L6 = Inductor: Ind,Shielded,4.7uH,20%,1.7A,900mOhm,4x4x2mm; Manufacturer 1: Vishay; Manufacturer Part Number 1: IFSC1515AHER4R7M01; Published: 8-Jun-2000; LatestRevisionDate: 29-May-2009; LatestRevisionNote: IPC-7351 Footprint Added.; PackageReference: 4x4x2mm; Publisher: Altium Limited; Code_JEITA: 4x4x2mm; Code_IEC: 4x4x2mm; Sat_Current: *; Impedance: *; Type: *; Manufacturer 2: Yageo; Manufacturer Part Number 2: BWVS004040184R7M00; Manufacturer 3: Abracon; Manufacturer Part Number 3: ASPI-0418FS-4R7-T3; Max_Height: 0.60mm; PCB_Footprint: 4x4x2mm
R58 = Res3: Res,0R ohm,Jumper,0402; Manufacturer 1: Stackpol; Manufacturer Part Number 1: RMCF0402ZT0R00; Wattage: 63mW; Published: 8-Jun-2000; LatestRevisionDate: 29-May-2009; LatestRevisionNote: IPC-7351 Footprint Added.; PackageReference: RESC0402-01; Publisher: Altium Limited; PackageDescription: Chip Resistor; Voltage: *; Type: Thick Film; Manufacturer 2: Yageo; Manufacturer Part Number 2: RC0402FR-070RL; Manufacturer 3: Panasonic; Manufacturer Part Number 3: ERJ-XGN0R00Y; PCB_Footprint: RESC0402-01
R59 = Res3: as R49 on sheet 8-SensorsAndJTAG; Published: 8-Jun-2000; LatestRevisionDate: 29-May-2009; LatestRevisionNote: IPC-7351 Footprint Added.; PackageReference: RESC0402-01; Publisher: Altium Limited; PackageDescription: Chip Resistor; Voltage: *; Type: Thick Film; Manufacturer 2: Yageo; Manufacturer Part Number 2: RC0402FR-07100KL; Manufacturer 3: Bourns; Manufacturer Part Number 3: CR0402-FX-1003GLF; PCB_Footprint: RESC0402-01
R60 = Res3: Res,4R99,1%,100ppm,0402; Manufacturer 1: Vishay; Manufacturer Part Number 1: CRCW04024R99FKED; Wattage: 50mW; Published: 8-Jun-2000; LatestRevisionDate: 29-May-2009; LatestRevisionNote: IPC-7351 Footprint Added.; PackageReference: RESC0402-01; Publisher: Altium Limited; PackageDescription: Chip Resistor; Voltage: *; Type: Thick Film; Manufacturer 2: Vishay; Manufacturer Part Number 2: CRCW04024R99FKEDHP; PCB_Footprint: RESC0402-01
R61 R64 = Res3: Res,10K0,1%,100ppm,0402; Manufacturer 1: Stackpol; Manufacturer Part Number 1: RMCF0402FT10K0; Wattage: 63mW; Published: 8-Jun-2000; LatestRevisionDate: 29-May-2009; LatestRevisionNote: IPC-7351 Footprint Added.; PackageReference: RESC0402-01; Publisher: Altium Limited; PackageDescription: Chip Resistor; Voltage: *; Type: Thick Film; Manufacturer 2: Yageo; Manufacturer Part Number 2: RC0402FR-0710KL; Manufacturer 3: Bourns; Manufacturer Part Number 3: CR0402-FX-1002GLF; PCB_Footprint: RESC0402-01
R62 R63 = Res3: Res,5K11,1%,100ppm,0402; Manufacturer 1: KOA; Manufacturer Part Number 1: RK73H1ETTP5111F; Wattage: 63mW; Published: 8-Jun-2000; LatestRevisionDate: 29-May-2009; LatestRevisionNote: IPC-7351 Footprint Added.; PackageReference: RESC0402-01; Publisher: Altium Limited; PackageDescription: Chip Resistor; Voltage: *; Type: Thick Film; Manufacturer 2: Yageo; Manufacturer Part Number 2: RC0402FR-075K11L; Manufacturer 3: Bourns; Manufacturer Part Number 3: CR0402-FX-5111GLF; PCB_Footprint: RESC0402-01
TP34-TP39 = TP_SMPAD: Test Point, SMT Pad,--not a BOM item--; PCB_Footprint: TP_PAD1
U18 = IC_BOOST_CAT4139TD-GT3: IC, Boost Converter, LED Driver; Manufacturer 1: MPS; Manufacturer Part Number 1: MP3301GJ; Manufacturer 2: *; Manufacturer Part Number 2: *

## Sheet 10-Click.SchDoc: B1 DevKit (DK-B1)
size 431 x 279 mm; Organization: ORGANIZATION; Address1: ADDRESS 1; Address2: ADDRESS 2; Address3: ADDRESS 3; Address4: ADDRESS 4; DocumentNumber: 11; Revision: -; SheetNumber: 10; SheetTotal: 14; ENG_APP_DATE: --/--/--; DSN_APP_DATE: --/--/--; CHK_APP_DATE: --/--/--
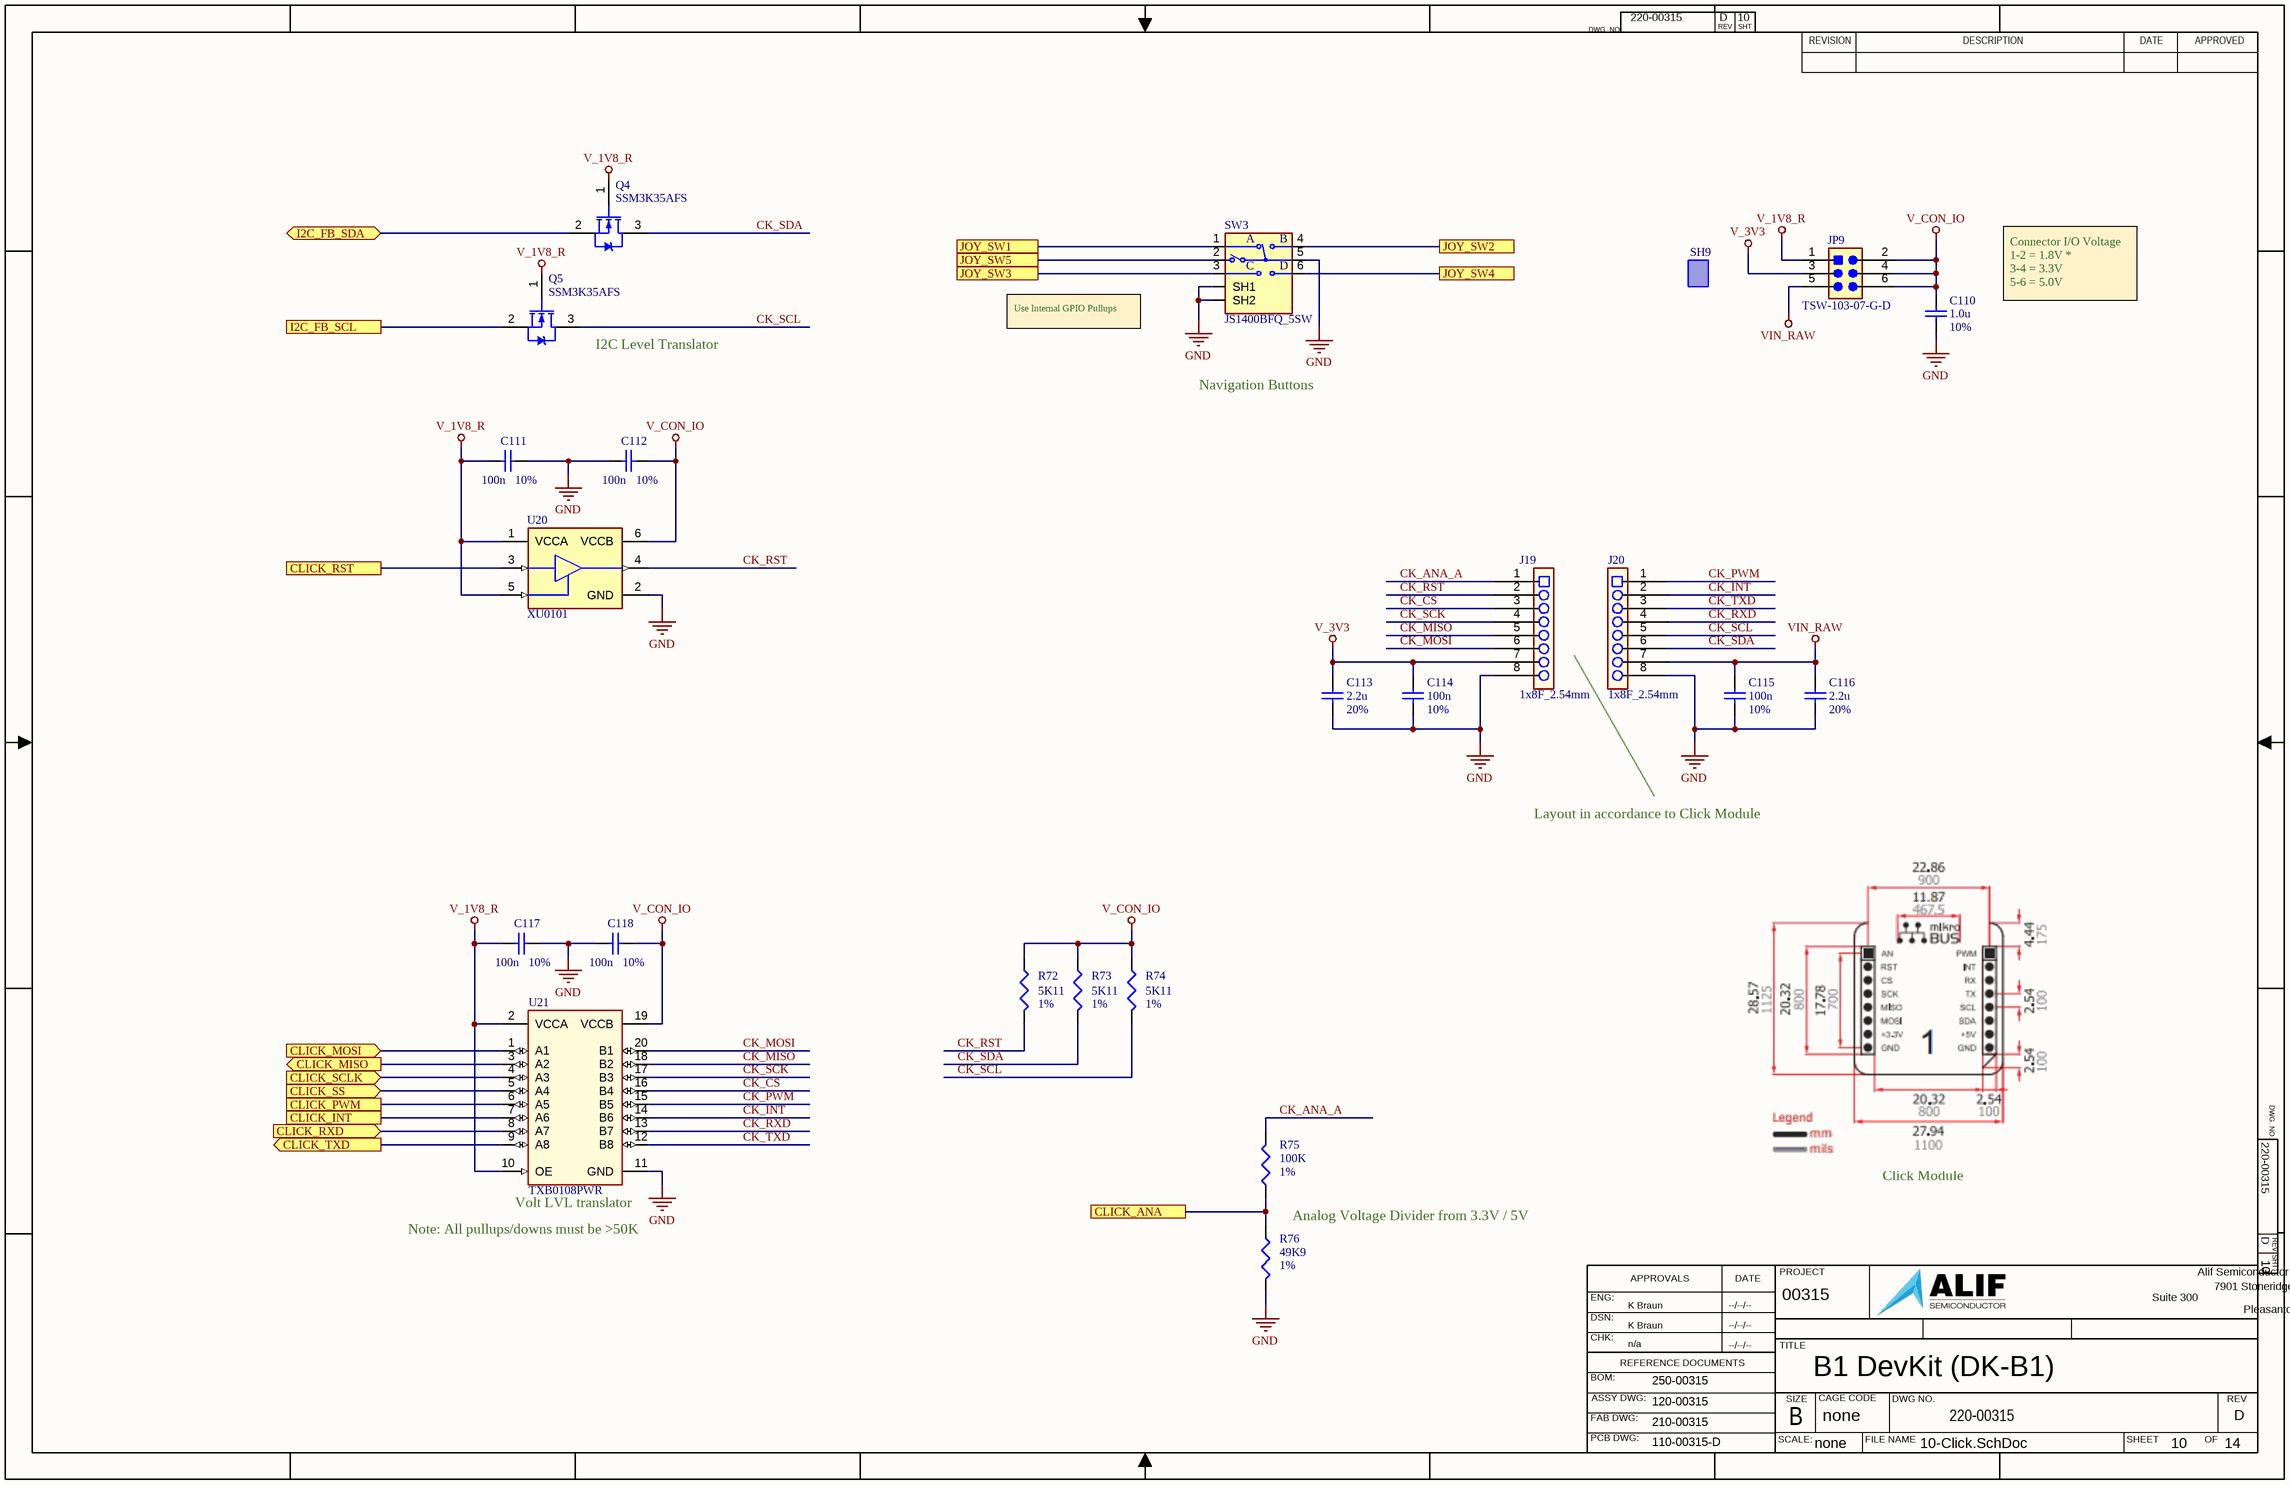
[diagram p9: 10-Click.SchDoc]

### Parts
C110  value 1.0u  Tolerance: 10%  [CAPC0402-01]  (hidden comment: Cap)
C111  value 100n  Tolerance: 10%  [CAPC0402-01]  (hidden comment: Cap)
C112  value 100n  Tolerance: 10%  [CAPC0402-01]  (hidden comment: Cap)
C113  value 2.2u  Tolerance: 20%  [CAPC0402-01]  (hidden comment: Cap_225M25VX5R0402_1)
C114  value 100n  Tolerance: 10%  [CAPC0402-01]  (hidden comment: Cap)
C115  value 100n  Tolerance: 10%  [CAPC0402-01]  (hidden comment: Cap)
C116  value 2.2u  Tolerance: 20%  [CAPC0402-01]  (hidden comment: Cap_225M25VX5R0402_1)
C117  value 100n  Tolerance: 10%  [CAPC0402-01]  (hidden comment: Cap)
C118  value 100n  Tolerance: 10%  [CAPC0402-01]  (hidden comment: Cap)
J19  value 1x8F_2.54mm  [RHDR8W80P0X254_1X8_2082X254X850P]  (hidden comment: Hdr_F_1x8_2.5MM_STRT_UNSH_1)
J20  value 1x8F_2.54mm  [RHDR8W80P0X254_1X8_2082X254X850P]  (hidden comment: Hdr_F_1x8_2.5MM_STRT_UNSH_1)
JP9  TSW-103-07-G-D  [HDRV6W64P254_2X3_762X508X838P]
Q4  Manufacturer Part Number 1: SSM3K35AFS  [SC75_SSM_TOS-L]  (hidden comment: NMOS-2_SOT)
Q5  Manufacturer Part Number 1: SSM3K35AFS  [SC75_SSM_TOS-L]  (hidden comment: NMOS-2_SOT)
R72  value 5K11  Tolerance: 1%  [RESC0402-01]  (hidden comment: Res3)
R73  value 5K11  Tolerance: 1%  [RESC0402-01]  (hidden comment: Res3)
R74  value 5K11  Tolerance: 1%  [RESC0402-01]  (hidden comment: Res3)
R75  value 100K  Tolerance: 1%  [RESC0402-01]  (hidden comment: Res3)
R76  value 49K9  Tolerance: 1%  [RESC0402-01]  (hidden comment: Res3)
SH9  Shunt  (value not drawn)  (mechanical)
SW3  JS1400BFQ_5SW  [SW_JS1400BFQ]
U20  XU0101  [SOT363_TI]
U21  TXB0108PWR  [TSSOP20_TI_PW0020A_M]

### Ports
CLICK_ANA, CLICK_INT, CLICK_MISO (out), CLICK_MOSI (in), CLICK_PWM, CLICK_RST, CLICK_RXD (in), CLICK_SCLK (in), CLICK_SS (in), CLICK_TXD (out), I2C_FB_SCL, I2C_FB_SDA (bidir), JOY_SW1, JOY_SW2, JOY_SW3, JOY_SW4, JOY_SW5

### Nets
GND: C110.1 C111.1 C112.2 C113.1 C114.1 C115.1 C116.1 C117.1 C118.2 J19.8 J20.8 R76.2 SW3.5(COM) SW3.SH1 SW3.SH2 U20.2(GND) U21.11(GND)
V_1V8_R: C111.2 C117.2 JP9.1 Q4.1(G) Q5.1(G) U20.1(VCCA) U20.5(OE) U21.2(VCCA) U21.10(OE)
V_3V3: C113.2 C114.2 J19.7 JP9.3
V_CON_IO: C110.2 C112.1 C118.1 JP9.2 JP9.4 JP9.6 R72.1 R73.1 R74.1 U20.6(VCCB) U21.19(VCCB)
VIN_RAW: C115.2 C116.2 J20.7 JP9.5
CK_ANA_A: J19.1 R75.2
CK_CS: J19.3 U21.16(B4)
CK_INT: J20.2 U21.14(B6)
CK_MISO: J19.5 U21.18(B2)
CK_MOSI: J19.6 U21.20(B1)
CK_PWM: J20.1 U21.15(B5)
CK_RST: J19.2 R72.2 U20.4(BY)
CK_RXD: J20.4 U21.13(B7)
CK_SCK: J19.4 U21.17(B3)
CK_SCL: J20.5 Q5.3(D) R74.2
CK_SDA: J20.6 Q4.3(D) R73.2
CK_TXD: J20.3 U21.12(B8)
I2C_FB_SCL: Q5.2(S) ; port I2C_FB_SCL
I2C_FB_SDA: Q4.2(S) ; port I2C_FB_SDA
P0_3: R75.1 R76.1 ; port CLICK_ANA
P5_0: SW3.1(A) ; port JOY_SW1
P5_4: SW3.4(B) ; port JOY_SW2
P5_5: SW3.3(C) ; port JOY_SW3
P5_6: SW3.6(D) ; port JOY_SW4
P5_7: SW3.2(E) ; port JOY_SW5
P6_4: U21.6(A5) ; port CLICK_PWM
P7_6: U20.3(A) ; port CLICK_RST
P7_7: U21.7(A6) ; port CLICK_INT
P8_2: U21.9(A8) ; port CLICK_TXD
P8_3: U21.8(A7) ; port CLICK_RXD
P8_4: U21.3(A2) ; port CLICK_MISO
P8_5: U21.1(A1) ; port CLICK_MOSI
P8_6: U21.4(A3) ; port CLICK_SCLK
P8_7: U21.5(A4) ; port CLICK_SS

### Notes on the sheet
- Connector I/O Voltage
  1-2 = 1.8V *
  3-4 = 3.3V
  5-6 = 5.0V
- (near Q5) I2C Level Translator
- Use Internal GPIO Pullups
- Navigation Buttons
- Layout in accordance to Click Module
- (near U21) Note: All pullups/downs must be >50K
- (near U21) Volt LVL translator
- Analog Voltage Divider from 3.3V / 5V
- Click Module
- DWG. NO.
- REV
- SHT
- REVISION
- DESCRIPTION
- DATE
- APPROVED
- ENG:
- APPROVALS
- PROJECT
- Suite 300
- Alif Semiconductor
- 7901 Stoneridge Drive
- DSN:
- CHK:
- REFERENCE DOCUMENTS
- TITLE
- Pleasanton, CA 94588  USA
- BOM:
- FAB DWG:
- PCB DWG:
- ASSY DWG:
- SCALE:
- SIZE
- B
- CAGE CODE
- FILE NAME
- DWG NO.
- SHEET
- OF
- none

### Library data of the parts
C110 = Cap: Cap,1.0uF,20%,25V,X5R,0402; Manufacturer 1: TDK; Manufacturer Part Number 1: CGB2A1X5R1E105K033BC; PCB_Footprint: CC0402; Published: 8-Jun-2000; LatestRevisionDate: 17-Jul-2002; LatestRevisionNote: Re-released for DXP Platform.; PackageReference: RAD-0.3; Publisher: Altium Limited; PackageDescription: Radial Cap, Thru-Hole; 2 Leads; 0.3 in Pin Spacing; Max_Height: 0.60mm; Manufacturer 2: Yageo; Manufacturer Part Number 2: CC0402KRX5R8BB105; Manufacturer 3: Murata; Manufacturer Part Number 3: GRM155R61E105KA12D; Type: X5R; Voltage: 25V
C111 C112 C114 C115 C117 C118 = Cap: as C77-C82 on sheet 7-IO_Headers; Published: 8-Jun-2000; LatestRevisionDate: 17-Jul-2002; LatestRevisionNote: Re-released for DXP Platform.; PackageReference: RAD-0.3; Publisher: Altium Limited; PackageDescription: Radial Cap, Thru-Hole; 2 Leads; 0.3 in Pin Spacing; Max_Height: 0.60mm; Manufacturer 2: Samsung; Manufacturer Part Number 2: CL05B104KB54PNC; Manufacturer 3: Walsin; Manufacturer Part Number 3: 0402B104K500CT; Type: X7R; Voltage: 50V
C113 C116 = Cap_225M25VX5R0402_1: as C85 on sheet 8-SensorsAndJTAG; Published: 8-Jun-2000; LatestRevisionDate: 17-Jul-2002; LatestRevisionNote: Re-released for DXP Platform.; PackageReference: RAD-0.3; Publisher: Altium Limited; PackageDescription: Radial Cap, Thru-Hole; 2 Leads; 0.3 in Pin Spacing; Max_Height: 0.60mm; Type: X5R; Voltage: 25V; Manufacturer 2: Murata; Manufacturer Part Number 2: GRM155R61E225ME11D; Manufacturer 3: Murata; Manufacturer Part Number 3: GRM155R61E225ME15D
J19 J20 = Hdr_F_1x8_2.5MM_STRT_UNSH_1: Hdr,Female,1x8,2.54mm,Strt,Unshrouded; Manufacturer 1: Sullins; Manufacturer Part Number 1: PPPC081LFBN-RC
JP9 = Hdr_M_2X3_2M54_STRT_UNSHROUDED: Hdr, Male,2x3, 2.54mm,0.230mate,0.100-0.120post,, Strt; Manufacturer 1: Samtec; Manufacturer Part Number 1: TSW-103-07-L-D; PCB_Footprint: *
Q4 Q5 = NMOS-2_SOT: MOSFET,N-CH,20V,250mA,1.1Ohm,SOT-23; Manufacturer 1: Toshiba; Note: Pin 2 is electrically connected to pin 4.; Value: 20V  180mA  2.4Ohm; Published: 8-Jun-2000; LatestRevisionDate: 17-Jul-2002; LatestRevisionNote: Re-released for DXP Platform.; DatasheetVersion: PD-9.814; PackageVersion: Feb-1997; PackageReference: TO-220AB; Publisher: Altium Limited; PackageDescription: TO, Thru-Hole, Vertical, Heatsink Mounted; 3 In-Line Leads; Pitch 2.54 mm; ComponentLink1Description: Manufacturer Link; ComponentLink1URL: http://www.irf.com/; Manufacturer 2: Rohm; Manufacturer Part Number 2: RUE002N02TL; Manufacturer 3: *; Manufacturer Part Number 3: *
R72-R74 = Res3: as R62 on sheet 9-MIPI; Published: 8-Jun-2000; LatestRevisionDate: 29-May-2009; LatestRevisionNote: IPC-7351 Footprint Added.; PackageReference: RESC0402-01; Publisher: Altium Limited; PackageDescription: Chip Resistor; Voltage: *; Type: Thick Film; Manufacturer 2: Yageo; Manufacturer Part Number 2: RC0402FR-075K11L; Manufacturer 3: Bourns; Manufacturer Part Number 3: CR0402-FX-5111GLF; PCB_Footprint: RESC0402-01
R75 = Res3: as R49 on sheet 8-SensorsAndJTAG; Published: 8-Jun-2000; LatestRevisionDate: 29-May-2009; LatestRevisionNote: IPC-7351 Footprint Added.; PackageReference: RESC0402-01; Publisher: Altium Limited; PackageDescription: Chip Resistor; Voltage: *; Type: Thick Film; Manufacturer 2: Yageo; Manufacturer Part Number 2: RC0402FR-07100KL; Manufacturer 3: Bourns; Manufacturer Part Number 3: CR0402-FX-1003GLF; PCB_Footprint: RESC0402-01
R76 = Res3: Res,49K9,1%,100ppm,0402; Manufacturer 1: Stackpol; Manufacturer Part Number 1: RMCF0402FT49K9; Wattage: 63mW; Published: 8-Jun-2000; LatestRevisionDate: 29-May-2009; LatestRevisionNote: IPC-7351 Footprint Added.; PackageReference: RESC0402-01; Publisher: Altium Limited; PackageDescription: Chip Resistor; Voltage: *; Type: Thick Film; Manufacturer 2: Yageo; Manufacturer Part Number 2: RC0402FR-0749K9L; Manufacturer 3: Bourns; Manufacturer Part Number 3: CR0402-FX-4992GLF; PCB_Footprint: RESC0402-01
SH9 = SHUNT_F_1x2_2.5MM_STRT: Shunt,Female,1x2,2.54mm,Gold,Strt; Manufacturer 1: Samtec; Manufacturer Part Number 1: SNT-100-BK-H; Manufacturer 2: Adam Tech; Manufacturer Part Number 2: MSB-G
SW3 = JS1400BFQ_5SW: Navigation Switch, 2 - Axis Digital (Mechanical Switch) Output; Manufacturer 1: ESwitch; MF: E-Switch; Digi-Key_Part_Number: EG5858-ND; MP: JS1400BFQ; Value: *; SnapEDA_Link: https://www.snapeda.com/parts/JS1400BFQ/E-Switch/view-part/2768291/?ref=snap; Package: None; Manufacturer Part Number 1: JS1400BFQ; Manufacturer 2: Diptronics; Manufacturer Part Number 2: MT5-1F-V
U20 = IC_XLAT_TXU0101DCKR: IC, Voltage Level Translator, Uni-Dir, 1-bit,push-pull,200MHz,VCCI: 1.2V to 5V and VCCO: 1.2V to 5V,SOT363; Manufacturer 1: TI; Manufacturer Part Number 1: TXU0101DCKR; Manufacturer 2: Nexperia; Manufacturer Part Number 2: NXU0101GWH; Manufacturer 3: Nexperia; Manufacturer Part Number 3: NXU0101GW-Q100H
U21 = IC_XLAT_TXB0108PWR: IC, Voltage Level Translator, 8-bit,push-pull,100Mbps,VCC(A): 1.2V to 3.6V and VCC(B): 1.65V to 5.5V,auto-sense,TSSOP20; Manufacturer 1: TI; TYPE: TYPE; Manufacturer Part Number 1: TXB0108PWR; Manufacturer 2: TI; Manufacturer Part Number 2: TXB0108PWRG4

## Sheet 11-CPU_GPIO.SchDoc: B1 DevKit (DK-B1)
size 431 x 279 mm; Organization: ORGANIZATION; Address1: ADDRESS 1; Address2: ADDRESS 2; Address3: ADDRESS 3; Address4: ADDRESS 4; DocumentNumber: 12; Revision: -; SheetNumber: 11; SheetTotal: 14; ENG_APP_DATE: --/--/--; DSN_APP_DATE: --/--/--; CHK_APP_DATE: --/--/--
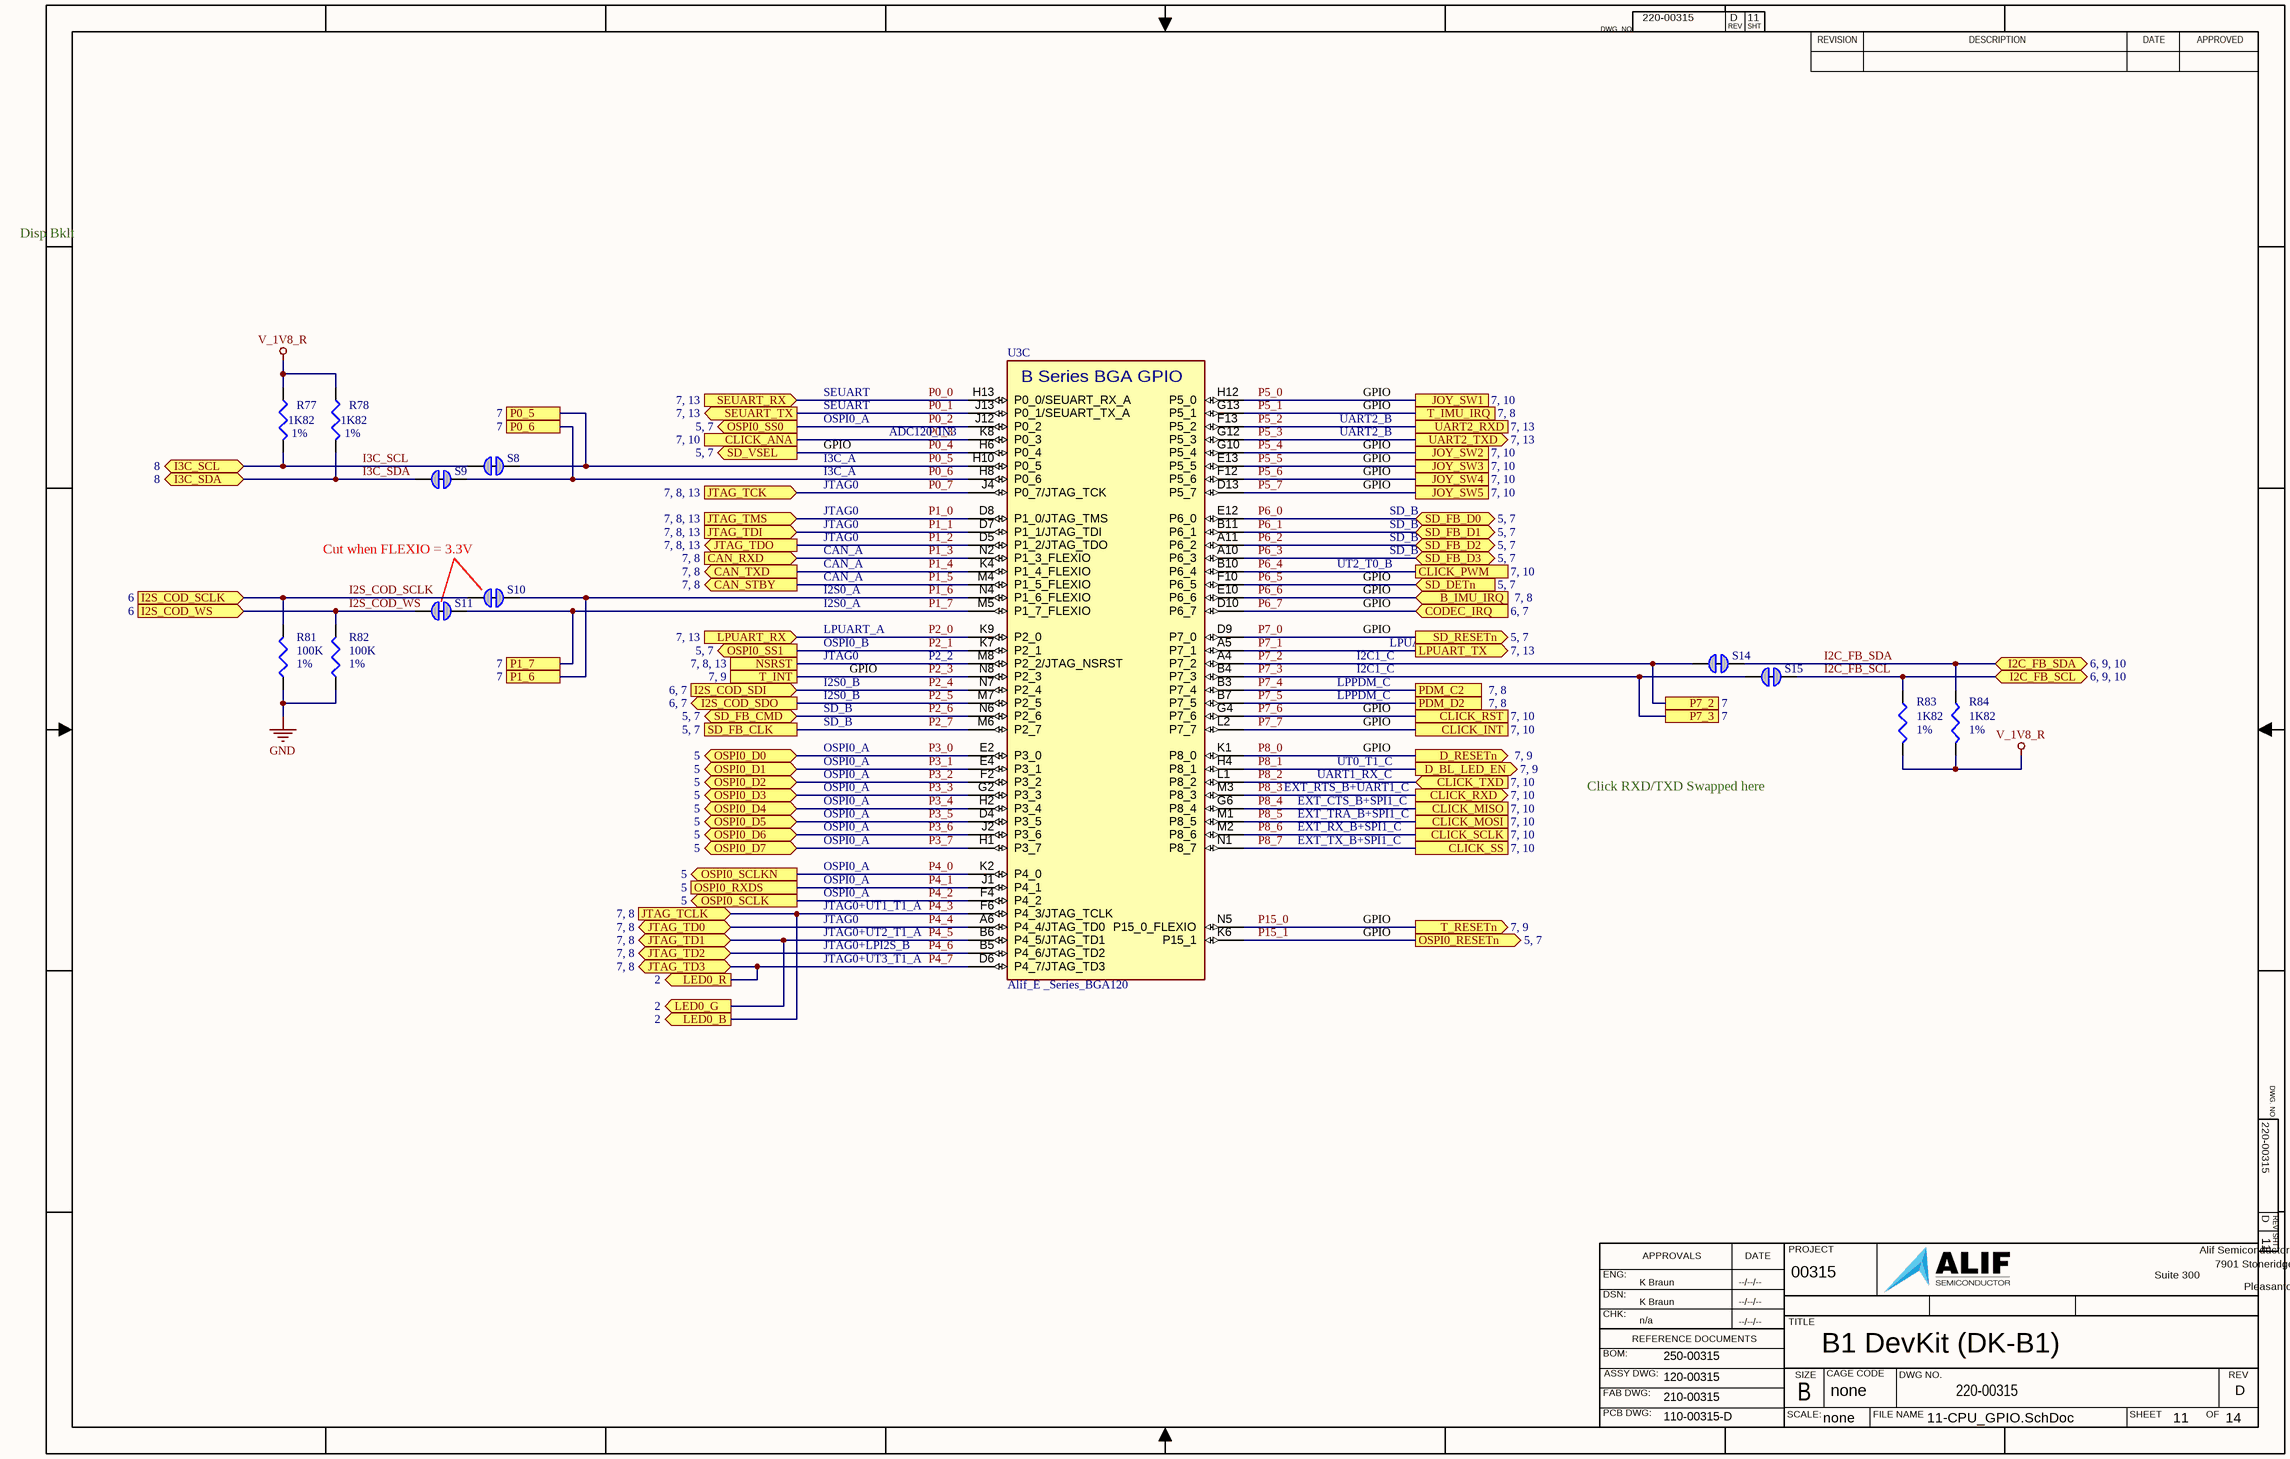
[diagram p10: 11-CPU_GPIO.SchDoc]

### Parts
R77  value 1K82  Tolerance: 1%  [RESC0402-01]  (hidden comment: Res3)
R78  value 1K82  Tolerance: 1%  [RESC0402-01]  (hidden comment: Res3)
R81  value 100K  Tolerance: 1%  [RESC0402-01]  (hidden comment: Res3)
R82  value 100K  Tolerance: 1%  [RESC0402-01]  (hidden comment: Res3)
R83  value 1K82  Tolerance: 1%  [RESC0402-01]  (hidden comment: Res3)
R84  value 1K82  Tolerance: 1%  [RESC0402-01]  (hidden comment: Res3)
S8  SolderJumperShorted_Small  [Solderbridge_Shorted]  (value not drawn)  (net tie, no BOM)
S9  SolderJumperShorted_Small  [Solderbridge_Shorted]  (value not drawn)  (net tie, no BOM)
S10  SolderJumperShorted_Small  [Solderbridge_Shorted]  (value not drawn)  (net tie, no BOM)
S11  SolderJumperShorted_Small  [Solderbridge_Shorted]  (value not drawn)  (net tie, no BOM)
S14  SolderJumperShorted_Small  [Solderbridge_Shorted]  (value not drawn)  (net tie, no BOM)
S15  SolderJumperShorted_Small  [Solderbridge_Shorted]  (value not drawn)  (net tie, no BOM)
U3  Alif_E _Series_BGA120  [BGA120_socket-NO_SOCK_3D]  (part C of 4)

### Ports
B_IMU_IRQ (in, see 7, 8), CAN_RXD (in, see 7, 8), CAN_STBY (out, see 7, 8), CAN_TXD (out, see 7, 8), CLICK_ANA (see 7, 10), CLICK_INT (see 7, 10), CLICK_MISO (see 7, 10), CLICK_MOSI (see 7, 10), CLICK_PWM (see 7, 10), CLICK_RST (see 7, 10), CLICK_RXD (out, see 7, 10), CLICK_SCLK (see 7, 10), CLICK_SS (see 7, 10), CLICK_TXD (in, see 7, 10), CODEC_IRQ (in, see 6, 7), D_BL_LED_EN (out, see 7, 9), D_RESETn (out, see 7, 9), I2C_FB_SCL (bidir, see 6, 9, 10), I2C_FB_SDA (bidir, see 6, 9, 10), I2S_COD_SCLK (in, see 6), I2S_COD_SDI (in, see 6, 7), I2S_COD_SDO (out, see 6, 7), I2S_COD_WS (in, see 6), I3C_SCL (bidir, see 8), I3C_SDA (bidir, see 8), JOY_SW1 (see 7, 10), JOY_SW2 (see 7, 10), JOY_SW3 (see 7, 10), JOY_SW4 (see 7, 10), JOY_SW5 (see 7, 10), JTAG_TCK (in, see 7, 8, 13), JTAG_TCLK (in, see 7, 8), JTAG_TD0 (bidir, see 7, 8), JTAG_TD1 (bidir, see 7, 8), JTAG_TD2 (bidir, see 7, 8), JTAG_TD3 (bidir, see 7, 8), JTAG_TDI (in, see 7, 8, 13), JTAG_TDO (out, see 7, 8, 13), JTAG_TMS (in, see 7, 8, 13), LED0_B (out, see 2), LED0_G (out, see 2), LED0_R (out, see 2), LPUART_RX (in, see 7, 13), LPUART_TX (out, see 7, 13), NSRST (see 7, 8, 13), OSPI0_D0 (bidir, see 5), OSPI0_D1 (bidir, see 5), OSPI0_D2 (bidir, see 5), OSPI0_D3 (bidir, see 5), OSPI0_D4 (bidir, see 5), OSPI0_D5 (bidir, see 5), OSPI0_D6 (bidir, see 5), OSPI0_D7 (bidir, see 5), OSPI0_RESETn (out, see 5, 7), OSPI0_RXDS (see 5), OSPI0_SCLK (out, see 5), OSPI0_SCLKN (out, see 5), OSPI0_SS0 (out, see 5, 7), OSPI0_SS1 (out, see 5, 7), P0_5 (see 7), P0_6 (see 7), P1_6 (see 7), P1_7 (see 7), P7_2 (see 7), P7_3 (see 7), PDM_C2 (see 7, 8), PDM_D2 (see 7, 8), SD_DETn (in, see 5, 7), SD_FB_CLK (see 5, 7), SD_FB_CMD (bidir, see 5, 7), SD_FB_D0 (bidir, see 5, 7), SD_FB_D1 (bidir, see 5, 7), SD_FB_D2 (bidir, see 5, 7), SD_FB_D3 (bidir, see 5, 7), SD_RESETn (out, see 5, 7), SD_VSEL (out, see 5, 7), SEUART_RX (in, see 7, 13), SEUART_TX (out, see 7, 13), T_IMU_IRQ (see 7, 8), T_INT (see 7, 9), T_RESETn (out, see 7, 9), UART2_RXD (see 7, 13), UART2_TXD (out, see 7, 13)

### Nets
GND: R81.1 R82.1
V_1V8_R: R77.2 R78.2 R83.2 R84.2
I2C_FB_SCL: R83.1 S15.1 ; port I2C_FB_SCL
I2C_FB_SDA: R84.1 S14.1 ; port I2C_FB_SDA
I2S_COD_SCLK: R81.2 S10.1 ; port I2S_COD_SCLK
I2S_COD_WS: R82.2 S11.1 ; port I2S_COD_WS
I3C_SCL: R77.1 S8.1 ; port I3C_SCL
I3C_SDA: R78.1 S9.1 ; port I3C_SDA
NSRST: U3.M8(P2_2/JTAG_NSRST) ; port NSRST
P0_0: U3.H13(P0_0/SEUART_RX_A) ; port SEUART_RX
P0_1: U3.J13(P0_1/SEUART_TX_A) ; port SEUART_TX
P0_2: U3.J12(P0_2) ; port OSPI0_SS0
P0_3: U3.K8(P0_3) ; port CLICK_ANA
P0_4: U3.H6(P0_4) ; port SD_VSEL
P0_5: S8.2 U3.H10(P0_5) ; port P0_5
P0_6: S9.2 U3.H8(P0_6) ; port P0_6
P0_7: U3.J4(P0_7/JTAG_TCK) ; port JTAG_TCK
P1_0: U3.D8(P1_0/JTAG_TMS) ; port JTAG_TMS
P1_1: U3.D7(P1_1/JTAG_TDI) ; port JTAG_TDI
P1_2: U3.D5(P1_2/JTAG_TDO) ; port JTAG_TDO
P1_3: U3.N2(P1_3_FLEXIO) ; port CAN_RXD
P1_4: U3.K4(P1_4_FLEXIO) ; port CAN_TXD
P1_5: U3.M4(P1_5_FLEXIO) ; port CAN_STBY
P1_6: S10.2 U3.N4(P1_6_FLEXIO) ; port P1_6
P1_7: S11.2 U3.M5(P1_7_FLEXIO) ; port P1_7
P2_0: U3.K9(P2_0) ; port LPUART_RX
P2_1: U3.K7(P2_1) ; port OSPI0_SS1
P2_3: U3.N8(P2_3) ; port T_INT
P2_4: U3.N7(P2_4) ; port I2S_COD_SDI
P2_5: U3.M7(P2_5) ; port I2S_COD_SDO
P2_6: U3.N6(P2_6) ; port SD_FB_CMD
P2_7: U3.M6(P2_7) ; port SD_FB_CLK
P3_0: U3.E2(P3_0) ; port OSPI0_D0
P3_1: U3.E4(P3_1) ; port OSPI0_D1
P3_2: U3.F2(P3_2) ; port OSPI0_D2
P3_3: U3.G2(P3_3) ; port OSPI0_D3
P3_4: U3.H2(P3_4) ; port OSPI0_D4
P3_5: U3.D4(P3_5) ; port OSPI0_D5
P3_6: U3.J2(P3_6) ; port OSPI0_D6
P3_7: U3.H1(P3_7) ; port OSPI0_D7
P4_0: U3.K2(P4_0) ; port OSPI0_SCLKN
P4_1: U3.J1(P4_1) ; port OSPI0_RXDS
P4_2: U3.F4(P4_2) ; port OSPI0_SCLK
P4_3: U3.F6(P4_3/JTAG_TCLK) ; port JTAG_TCLK, port LED0_B
P4_4: U3.A6(P4_4/JTAG_TD0) ; port JTAG_TD0
P4_5: U3.B6(P4_5/JTAG_TD1) ; port JTAG_TD1, port LED0_G
P4_6: U3.B5(P4_6/JTAG_TD2) ; port JTAG_TD2
P4_7: U3.D6(P4_7/JTAG_TD3) ; port JTAG_TD3, port LED0_R
P5_0: U3.H12(P5_0) ; port JOY_SW1
P5_1: U3.G13(P5_1) ; port T_IMU_IRQ
P5_2: U3.F13(P5_2) ; port UART2_RXD
P5_3: U3.G12(P5_3) ; port UART2_TXD
P5_4: U3.G10(P5_4) ; port JOY_SW2
P5_5: U3.E13(P5_5) ; port JOY_SW3
P5_6: U3.F12(P5_6) ; port JOY_SW4
P5_7: U3.D13(P5_7) ; port JOY_SW5
P6_0: U3.E12(P6_0) ; port SD_FB_D0
P6_1: U3.B11(P6_1) ; port SD_FB_D1
P6_2: U3.A11(P6_2) ; port SD_FB_D2
P6_3: U3.A10(P6_3) ; port SD_FB_D3
P6_4: U3.B10(P6_4) ; port CLICK_PWM
P6_5: U3.F10(P6_5) ; port SD_DETn
P6_6: U3.E10(P6_6) ; port B_IMU_IRQ
P6_7: U3.D10(P6_7) ; port CODEC_IRQ
P7_0: U3.D9(P7_0) ; port SD_RESETn
P7_1: U3.A5(P7_1) ; port LPUART_TX
P7_2: S14.2 U3.A4(P7_2) ; port P7_2
P7_3: S15.2 U3.B4(P7_3) ; port P7_3
P7_4: U3.B3(P7_4) ; port PDM_C2
P7_5: U3.B7(P7_5) ; port PDM_D2
P7_6: U3.G4(P7_6) ; port CLICK_RST
P7_7: U3.L2(P7_7) ; port CLICK_INT
P8_0: U3.K1(P8_0) ; port D_RESETn
P8_1: U3.H4(P8_1) ; port D_BL_LED_EN
P8_2: U3.L1(P8_2) ; port CLICK_TXD
P8_3: U3.M3(P8_3) ; port CLICK_RXD
P8_4: U3.G6(P8_4) ; port CLICK_MISO
P8_5: U3.M1(P8_5) ; port CLICK_MOSI
P8_6: U3.M2(P8_6) ; port CLICK_SCLK
P8_7: U3.N1(P8_7) ; port CLICK_SS
P15_0: U3.N5(P15_0_FLEXIO) ; port T_RESETn
P15_1: U3.K6(P15_1) ; port OSPI0_RESETn

### Notes on the sheet
- Disp Bklt
- OSPI0_A
- SEUART
- UART2_B
- GPIO
- JTAG0
- I3C_A
- ADC120_IN3
- Cut when FLEXIO = 3.3V
- CAN_A
- SD_B
- I2S0_A
- UT2_T0_B
- LPUART_A
- I2S0_B
- OSPI0_B
- P2_2
- LPPDM_C
- I2C1_C
- LPUART_C
- EXT_RTS_B+UART1_C
- EXT_CTS_B+SPI1_C
- EXT_TRA_B+SPI1_C
- UART1_RX_C
- UT0_T1_C
- Click RXD/TXD Swapped here
- EXT_RX_B+SPI1_C
- EXT_TX_B+SPI1_C
- JTAG0+UT1_T1_A
- JTAG0+UT2_T1_A
- JTAG0+LPI2S_B
- JTAG0+UT3_T1_A
- DWG. NO.
- REV
- SHT
- REVISION
- DESCRIPTION
- DATE
- APPROVED
- ENG:
- APPROVALS
- PROJECT
- Suite 300
- Alif Semiconductor
- 7901 Stoneridge Drive
- DSN:
- CHK:
- REFERENCE DOCUMENTS
- TITLE
- Pleasanton, CA 94588  USA
- BOM:
- FAB DWG:
- PCB DWG:
- ASSY DWG:
- SCALE:
- SIZE
- B
- CAGE CODE
- FILE NAME
- DWG NO.
- SHEET
- OF
- none
- (in symbol SPARK_B1_120BGA_A5, part C) B Series BGA GPIO

### Library data of the parts
R77 R78 R83 R84 = Res3: Res,1K82,1%,100ppm,0402; Manufacturer 1: Stackpol; Manufacturer Part Number 1: RMCF0402FT1K82; Wattage: 63mW; Published: 8-Jun-2000; LatestRevisionDate: 29-May-2009; LatestRevisionNote: IPC-7351 Footprint Added.; PackageReference: RESC0402-01; Publisher: Altium Limited; PackageDescription: Chip Resistor; Voltage: *; Type: Thick Film; Manufacturer 2: Yageo; Manufacturer Part Number 2: RC0402FR-071K82L; Manufacturer 3: Bourns; Manufacturer Part Number 3: CR0402-FX-1821GLF; PCB_Footprint: RESC0402-01
R81 R82 = Res3: as R49 on sheet 8-SensorsAndJTAG; Published: 8-Jun-2000; LatestRevisionDate: 29-May-2009; LatestRevisionNote: IPC-7351 Footprint Added.; PackageReference: RESC0402-01; Publisher: Altium Limited; PackageDescription: Chip Resistor; Voltage: *; Type: Thick Film; Manufacturer 2: Yageo; Manufacturer Part Number 2: RC0402FR-07100KL; Manufacturer 3: Bourns; Manufacturer Part Number 3: CR0402-FX-1003GLF; PCB_Footprint: RESC0402-01
S8-S11 S14 S15 = SolderJumperShorted_Small: as S7 on sheet 8-SensorsAndJTAG; Published: 8-Jun-2000; LatestRevisionDate: 29-May-2009; LatestRevisionNote: IPC-7351 Footprint Added.; PackageReference: J1-0603; Publisher: Altium Limited; PackageDescription: Chip Resistor; Voltage: *; Type: Thick Film; Manufacturer 1: *; Manufacturer Part Number 1: *; Manufacturer 2: *; Manufacturer Part Number 2: *; Manufacturer 3: *; Manufacturer Part Number 3: *; Tolerance: *; Value: *
U3 = SPARK_B1_120BGA_A5: IC,Alif Spark B1 MCU, Rev A5 silicon,BGA120; Manufacturer 1: Alif Semi; Manufacturer Part Number 1: AB1C1F4M51820PH0